# EAGLE design vh_21c (EAGLE 9.5.1)

## Sheet 1 of 2
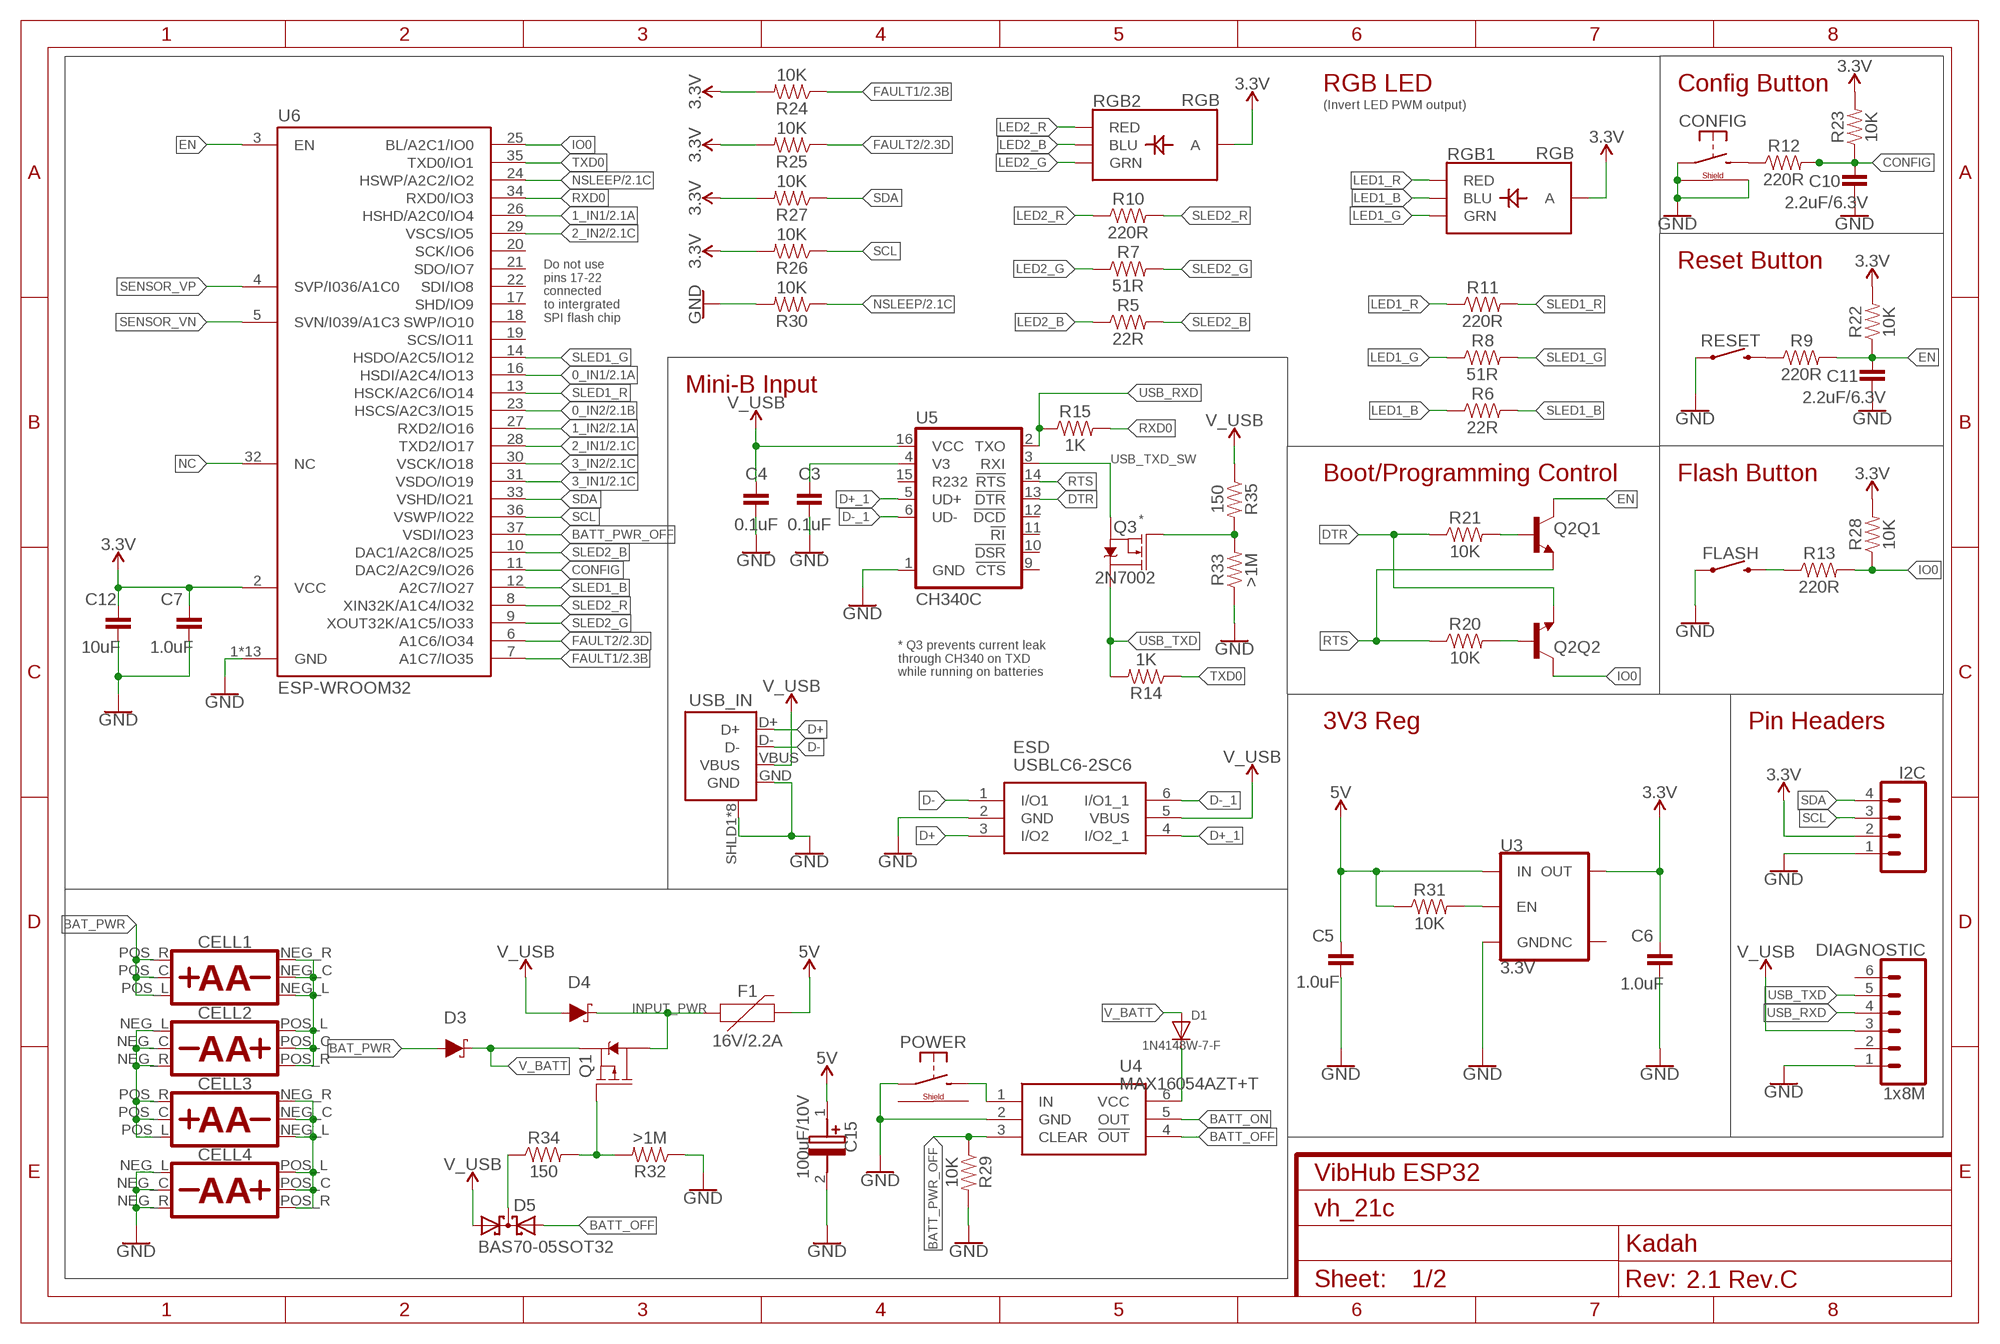
[diagram p0: schematic, sheet 1]
FRAME1 (FRAME-A4L): CNAME: VibHub ESP32; CREVISION: 2.1 Rev.C; DESIGNER: Kadah

### Parts
C3  0.1uF  CAPACITOR-0805  [C0805]
C4  0.1uF  CAPACITOR-0805  [C0805]
C5  1.0uF  CAPACITOR-0805  [C0805]
C6  1.0uF  CAPACITOR-0805  [C0805]
C7  1.0uF  CAPACITOR-0805  [C0805]
C10  2.2uF/6.3V  CAPACITOR-0805  [C0805]
C11  2.2uF/6.3V  CAPACITOR-0805  [C0805]
C12  10uF  CAPACITOR-0805  [C0805]
C15  100uF/10V  F931C107KCC  [CAPPM6032X270N]
CELL1  AA_590_596  [AA_590_596]
CELL2  AA_590_596  [AA_590_596]
CELL3  AA_590_596  [AA_590_596]
CELL4  AA_590_596  [AA_590_596]
CONFIG  MOMENTARY-SWITCH-SPST-RIGHTSQ75  [SW6X6_RIGHT_SQ73]
D1  1N4148W-7-F  DIODE-SOD-123  [SOD-123]
D3  3A/40V/500mV  DIODE-SCHOTTKY-B340A  [SMA-DIODE]
D4  3A/40V/500mV  DIODE-SCHOTTKY-B340A  [SMA-DIODE]
D5  BAS70-05SOT32  [SOT91P240X110-3]
DIAGNOSTIC  1x8M  CONN_06LOCK  [1X06_LOCK]
ESD  USBLC6-2SC6  [SOT95P280X145-6N]
F1  16V/2.2A  PPTC1812  [FUSC7035X90]
FLASH  MOMENTARY-SWITCH-SPST-SMD-6.0X3.5MM  [TACTILE_SWITCH_SMD_6.0X3.5MM]
I2C  CONN_04  [1X04]
POWER  MOMENTARY-SWITCH-SPST-RIGHTSQ75  [SW6X6_RIGHT_SQ73]
Q1  MOSFET_PCH-DMG2305UX-13  [SOT91P240X110-3]
Q2  TRANS_NPN_DUAL-MBT3904DW1T1  [SC70-6]
Q3  2N7002  MOSFET-NCH-BSS138  [SOT23-3]
R5  22R  RESISTOR0805  [0805]
R6  22R  RESISTOR0805  [0805]
R7  51R  RESISTOR0805  [0805]
R8  51R  RESISTOR0805  [0805]
R9  220R  RESISTOR0805  [0805]
R10  220R  RESISTOR0805  [0805]
R11  220R  RESISTOR0805  [0805]
R12  220R  RESISTOR0805  [0805]
R13  220R  RESISTOR0805  [0805]
R14  1K  RESISTOR0805  [0805]
R15  1K  RESISTOR0805  [0805]
R20  10K  RESISTOR0805  [0805]
R21  10K  RESISTOR0805  [0805]
R22  10K  RESISTOR0805  [0805]
R23  10K  RESISTOR0805  [0805]
R24  10K  RESISTOR0805  [0805]
R25  10K  RESISTOR0805  [0805]
R26  10K  RESISTOR0805  [0805]
R27  10K  RESISTOR0805  [0805]
R28  10K  RESISTOR0805  [0805]
R29  10K  RESISTOR0805  [0805]
R30  10K  RESISTOR0805  [0805]
R31  10K  RESISTOR0805  [0805]
R32  >1M  RESISTOR0805  [0805]
R33  >1M  RESISTOR0805  [0805]
R34  150  RESISTOR0805  [0805]
R35  150  RESISTOR0805  [0805]
RESET  MOMENTARY-SWITCH-SPST-SMD-6.0X3.5MM  [TACTILE_SWITCH_SMD_6.0X3.5MM]
RGB1  RGB  LED-RGB-CAPLCC  [P-LCC-4-3]
RGB2  RGB  LED-RGB-CAPLCC  [P-LCC-4-3]
U3  3.3V  V_REG_AP2112K-3.3V  [SOT23-5]
U4  MAX16054AZT+T  [SOT95P275X110-6N]
U5  CH340C  [SO016]
U6  ESP-WROOM32  [ESP-WROOM32]
USB_IN  USB-MICROB-2  [USB-MICROB-10118194]

### Nets
0_IN1: U6.16(HSDI/A2C4/IO13) ; also sheet 2
0_IN2: U6.23(HSCS/A2C3/IO15) ; also sheet 2
1_IN1: U6.26(HSHD/A2C0/IO4) ; also sheet 2
1_IN2: U6.27(RXD2/IO16) ; also sheet 2
2_IN1: U6.28(TXD2/IO17) ; also sheet 2
2_IN2: U6.29(VSCS/IO5) ; also sheet 2
3.3V: C6.1 C7.1 C12.1 I2C.2 R22.2 R23.2 R24.2 R25.2 R26.2 R27.2 R28.2 RGB1.4(A) RGB2.4(A) U3.5(OUT) U6.2(VCC)
3_IN1: U6.31(VSDO/IO19) ; also sheet 2
3_IN2: U6.30(VSCK/IO18) ; also sheet 2
5V: C5.1 C15.1(+) F1.2 R31.1 U3.1(IN) ; also sheet 2
BAT_PWR: CELL1.POS_C CELL1.POS_L CELL1.POS_R D3.A
BATT_OFF: D5.2(A2) U4.4(!OUT)
BATT_ON: U4.5(OUT)
BATT_PWR_OFF: R29.1 U4.3(CLEAR) U6.37(VSDI/IO23)
CONFIG: C10.1 R12.2 R23.1 U6.11(DAC2/A2C9/IO26)
D+: ESD.3(I/O2) USB_IN.D+
D+_1: ESD.4(I/O2_1) U5.5(UD+)
D-: ESD.1(I/O1) USB_IN.D-
D-_1: ESD.6(I/O1_1) U5.6(UD-)
DTR: Q2.1(Q2:E) R21.1 U5.13(!DTR)
EN: C11.1 Q2.3(Q1:C) R9.2 R22.1 U6.3(EN)
EN_BASE: Q2.5(Q1:B) R21.2
FAULT1: R24.1 U6.7(A1C7/IO35) ; also sheet 2
FAULT2: R25.1 U6.6(A1C6/IO34) ; also sheet 2
GND: C3.2 C4.2 C5.2 C6.2 C7.2 C10.2 C11.2 C12.2 C15.2(-) CELL4.NEG_C CELL4.NEG_L CELL4.NEG_R CONFIG.2(P1) CONFIG.SHLD@1(SHIELD1) CONFIG.SHLD@2(SHIELD2) DIAGNOSTIC.1 ESD.2(GND) FLASH.1 I2C.1 POWER.2(P1) R29.2 R30.2 R32.1 R33.1 RESET.1 U3.2(GND) U4.2(GND) U5.1(GND) U6.1(GND) U6.15(GND) U6.38(GND) U6.TP1(GND) U6.TP2(GND) U6.TP3(GND) U6.TP4(GND) U6.TP5(GND) U6.TP6(GND) U6.TP7(GND) U6.TP8(GND) U6.TP9(GND) U6.TP(GND) USB_IN.GND USB_IN.SHLD1(SHIELD) USB_IN.SHLD2(SHIELD) USB_IN.SHLD3(SHIELD) USB_IN.SHLD4(SHIELD) USB_IN.SHLD5(SHIELD) USB_IN.SHLD6(SHIELD) USB_IN.SHLD7(SHIELD) USB_IN.SHLD8(SHIELD) ; also sheet 2
INPUT_PWR: D4.C F1.1 Q1.3(D)
IO0: Q2.6(Q2:C) R13.2 R28.1 U6.25(BL/A2C1/IO0)
IO0_BASE: Q2.2(Q2:B) R20.2
LED1_B: R6.1 RGB1.3(BLU)
LED1_G: R8.1 RGB1.2(GRN)
LED1_R: R11.1 RGB1.1(RED)
LED2_B: R5.1 RGB2.3(BLU)
LED2_G: R7.1 RGB2.2(GRN)
LED2_R: R10.1 RGB2.1(RED)
N$1: R31.2 U3.3(EN)
N$2: C3.1 U5.4(V3)
N$3: D5.3(C) R34.1
N$4: POWER.1(S1) U4.1(IN)
N$5: D1.C U4.6(VCC)
N$6: R9.1 RESET.2
N$7: CELL1.NEG_C CELL1.NEG_L CELL1.NEG_R CELL2.POS_C CELL2.POS_L CELL2.POS_R
N$8: CELL2.NEG_C CELL2.NEG_L CELL2.NEG_R CELL3.POS_C CELL3.POS_L CELL3.POS_R
N$10: CELL3.NEG_C CELL3.NEG_L CELL3.NEG_R CELL4.POS_C CELL4.POS_L CELL4.POS_R
N$12: CONFIG.1(S1) R12.1
N$15: Q1.1(G) R32.2 R34.2
N$16: Q3.1(G) R33.2 R35.2
N$31: FLASH.2 R13.1
NC: U6.32(NC)
NSLEEP: R30.1 U6.24(HSWP/A2C2/IO2) ; also sheet 2
RTS: Q2.4(Q1:E) R20.1 U5.14(!RTS)
RXD0: R15.2 U6.34(RXD0/IO3)
SCL: I2C.3 R26.1 U6.36(VSWP/IO22)
SDA: I2C.4 R27.1 U6.33(VSHD/IO21)
SENSOR_VN: U6.5(SVN/I039/A1C3)
SENSOR_VP: U6.4(SVP/I036/A1C0)
SLED1_B: R6.2 U6.12(A2C7/IO27)
SLED1_G: R8.2 U6.14(HSDO/A2C5/IO12)
SLED1_R: R11.2 U6.13(HSCK/A2C6/IO14)
SLED2_B: R5.2 U6.10(DAC1/A2C8/IO25)
SLED2_G: R7.2 U6.9(XOUT32K/A1C5/IO33)
SLED2_R: R10.2 U6.8(XIN32K/A1C4/IO32)
TXD0: R14.1 U6.35(TXD0/IO1)
USB_RXD: DIAGNOSTIC.4 R15.1 U5.2(TXO)
USB_TXD: DIAGNOSTIC.5 Q3.3(D) R14.2
USB_TXD_SW: Q3.2(S) U5.3(RXI)
V_BATT: D1.A D3.C Q1.2(S)
V_USB: C4.1 D4.A D5.1(A1) DIAGNOSTIC.3 ESD.5(VBUS) R35.1 U5.16(VCC) USB_IN.VBUS
Unconnected: DIAGNOSTIC.2 DIAGNOSTIC.6 POWER.SHLD@1(SHIELD1) POWER.SHLD@2(SHIELD2) U3.4(NC) U5.9(!CTS) U5.10(!DSR) U5.11(!RI) U5.12(!DCD) U5.15(R232) U6.17(SHD/IO9) U6.18(SWP/IO10) U6.19(SCS/IO11) U6.20(SCK/IO6) U6.21(SDO/IO7) U6.22(SDI/IO8)

### Notes on the sheet
- RGB LED | Config Button
- (Invert LED PWM output)
- Reset Button
- Do not use
  pins 17-22
  connected
  to intergrated
  SPI flash chip
- Mini-B Input
- Boot/Programming Control | Flash Button
- *
- * Q3 prevents current leak
  through CH340 on TXD 
  while running on batteries
- 3V3 Reg | Pin Headers

## Sheet 2 of 2
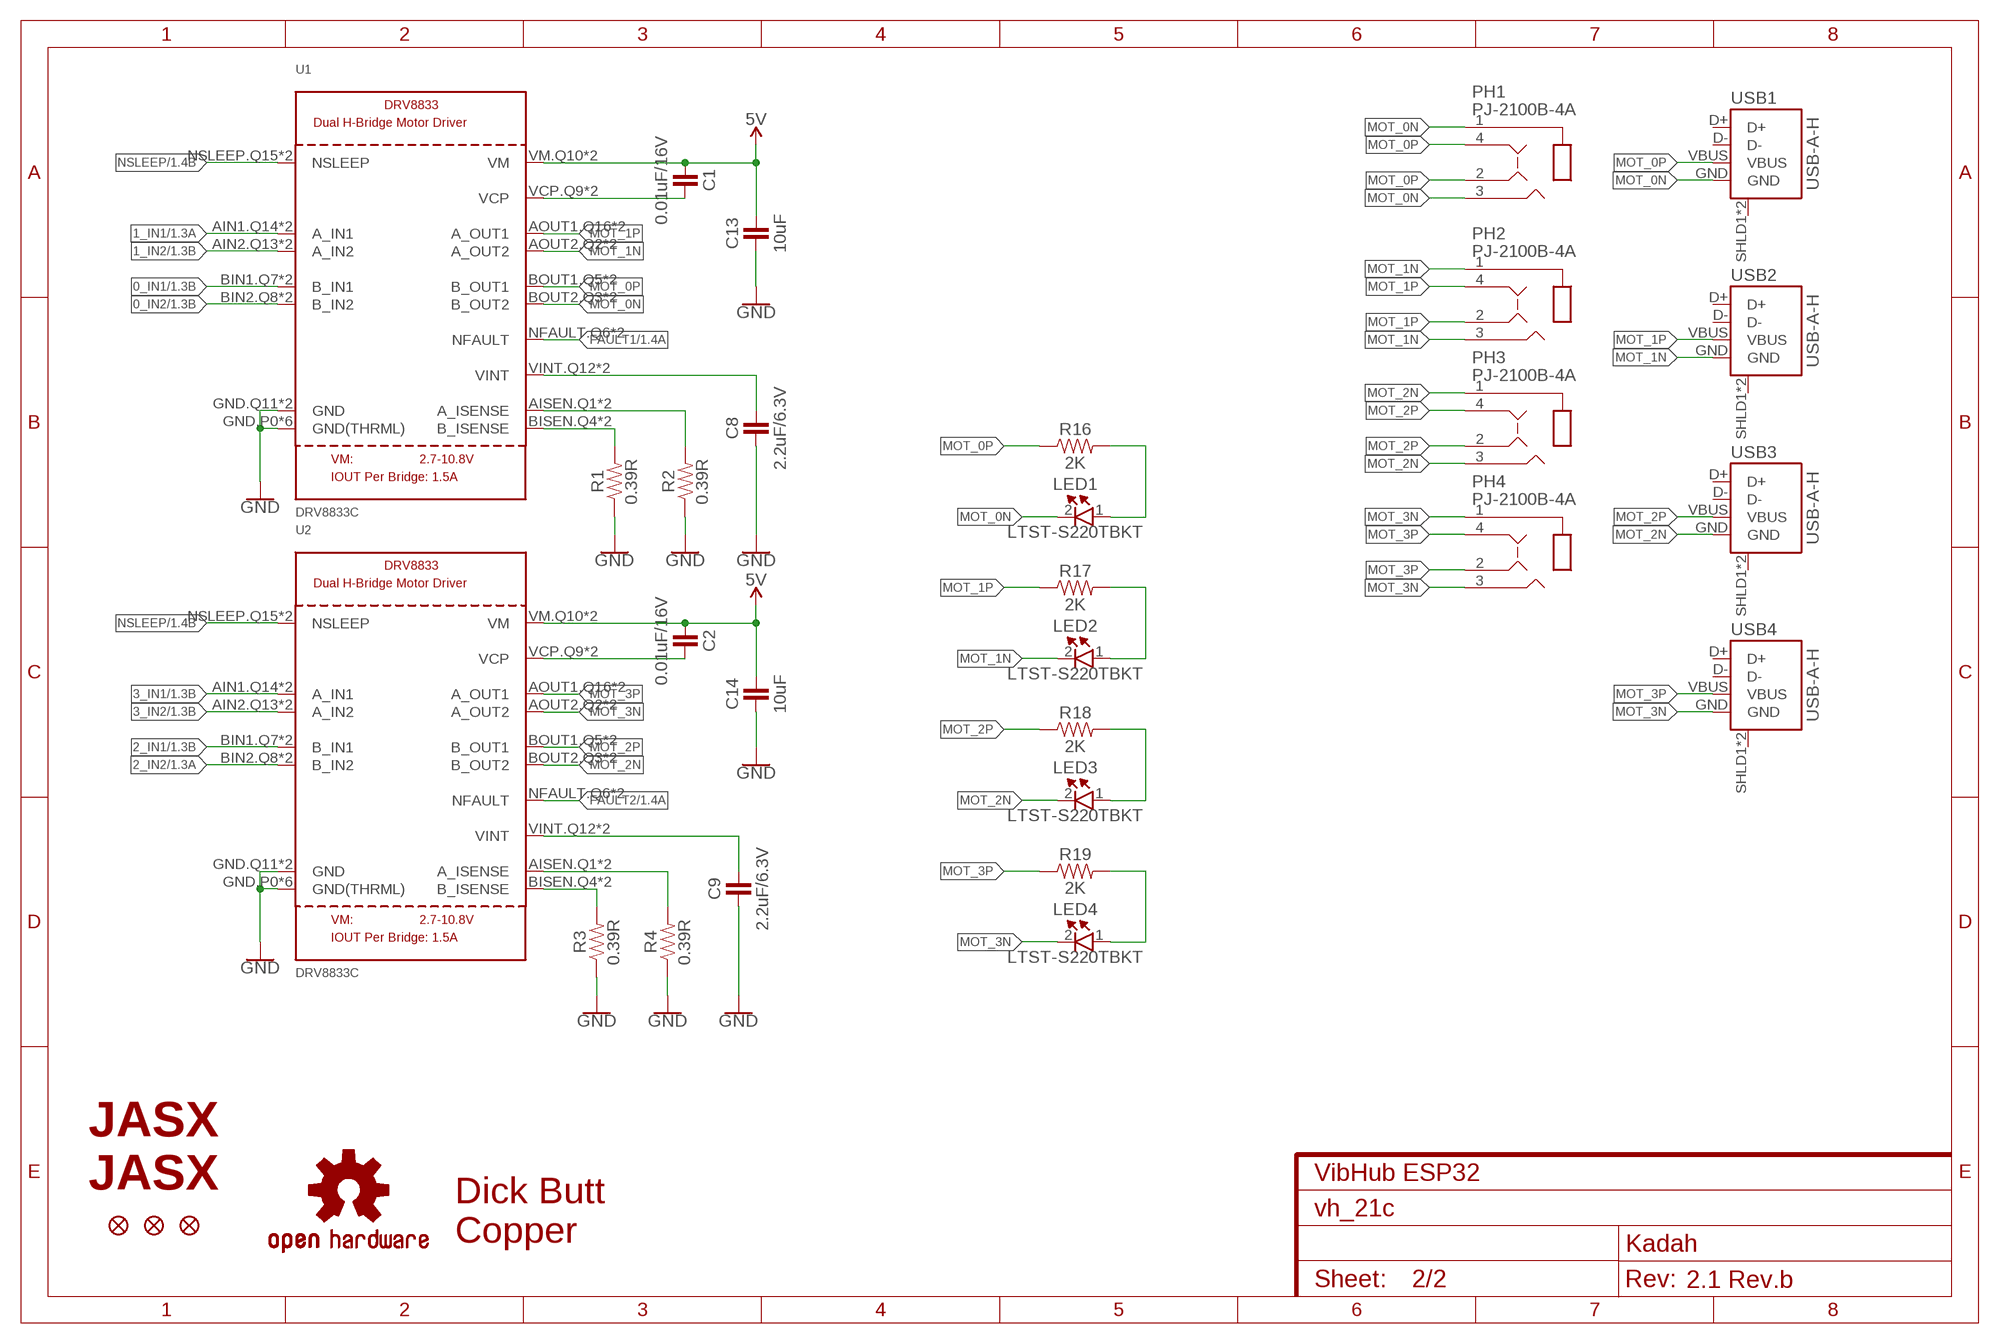
[diagram p1: schematic, sheet 2]
FRAME2 (FRAME-A4L): CNAME: VibHub ESP32; CREVISION: 2.1 Rev.b; DESIGNER: Kadah

### Parts
C1  0.01uF/16V  CAPACITOR-0805  [C0805]
C2  0.01uF/16V  CAPACITOR-0805  [C0805]
C8  2.2uF/6.3V  CAPACITOR-0805  [C0805]
C9  2.2uF/6.3V  CAPACITOR-0805  [C0805]
C13  10uF  CAPACITOR-0805  [C0805]
C14  10uF  CAPACITOR-0805  [C0805]
FD1  FIDUCIAL1X2  [FIDUCIAL-1X2]
FD2  FIDUCIAL1X2  [FIDUCIAL-1X2]
FD3  FIDUCIAL1X2  [FIDUCIAL-1X2]
LED1  LTST-S220TBKT  [LTST-S220KFKT]
LED2  LTST-S220TBKT  [LTST-S220KFKT]
LED3  LTST-S220TBKT  [LTST-S220KFKT]
LED4  LTST-S220TBKT  [LTST-S220KFKT]
LOGO1  OSHW-LOGOM  [OSHW-LOGO-M]
LOGO2  JASX_LOGO_MID  [JASX_LOGO_M]
LOGO3  DICKBUTTCOPPER  [DICKBUTT_COPPER]
LOGO4  JASX_LOGO_MID  [JASX_LOGO_M]
PH1  PJ-2100B-4A  [PJ2100B4A]
PH2  PJ-2100B-4A  [PJ2100B4A]
PH3  PJ-2100B-4A  [PJ2100B4A]
PH4  PJ-2100B-4A  [PJ2100B4A]
R1  0.39R  RESISTOR0805  [0805]
R2  0.39R  RESISTOR0805  [0805]
R3  0.39R  RESISTOR0805  [0805]
R4  0.39R  RESISTOR0805  [0805]
R16  2K  RESISTOR0805  [0805]
R17  2K  RESISTOR0805  [0805]
R18  2K  RESISTOR0805  [0805]
R19  2K  RESISTOR0805  [0805]
U1  DRV8833C  DRV8833COMBO  [DRV8833_COMBO]
U2  DRV8833C  DRV8833COMBO  [DRV8833_COMBO]
USB1  USB-A-H  [USB-A-H]
USB2  USB-A-H  [USB-A-H]
USB3  USB-A-H  [USB-A-H]
USB4  USB-A-H  [USB-A-H]

### Nets
0_IN1: U1.BIN1.Q7(B_IN1) U1.BIN1.T9(B_IN1) ; also sheet 1
0_IN2: U1.BIN2.Q8(B_IN2) U1.BIN2.T10(B_IN2) ; also sheet 1
1_IN1: U1.AIN1.Q14(A_IN1) U1.AIN1.T16(A_IN1) ; also sheet 1
1_IN2: U1.AIN2.Q13(A_IN2) U1.AIN2.T15(A_IN2) ; also sheet 1
2_IN1: U2.BIN1.Q7(B_IN1) U2.BIN1.T9(B_IN1) ; also sheet 1
2_IN2: U2.BIN2.Q8(B_IN2) U2.BIN2.T10(B_IN2) ; also sheet 1
3_IN1: U2.AIN1.Q14(A_IN1) U2.AIN1.T16(A_IN1) ; also sheet 1
3_IN2: U2.AIN2.Q13(A_IN2) U2.AIN2.T15(A_IN2) ; also sheet 1
5V: C1.1 C2.1 C13.2 C14.2 U1.VM.Q10(VM) U1.VM.T12(VM) U2.VM.Q10(VM) U2.VM.T12(VM) ; also sheet 1
A_ISENSE0: R2.2 U1.AISEN.Q1(A_ISENSE) U1.AISEN.T3(A_ISENSE)
A_ISENSE1: R4.2 U2.AISEN.Q1(A_ISENSE) U2.AISEN.T3(A_ISENSE)
B_ISENSE0: R1.2 U1.BISEN.Q4(B_ISENSE) U1.BISEN.T6(B_ISENSE)
B_ISENSE1: R3.2 U2.BISEN.Q4(B_ISENSE) U2.BISEN.T6(B_ISENSE)
FAULT1: U1.NFAULT.Q6(NFAULT) U1.NFAULT.T8(NFAULT) ; also sheet 1
FAULT2: U2.NFAULT.Q6(NFAULT) U2.NFAULT.T8(NFAULT) ; also sheet 1
GND: C8.1 C9.1 C13.1 C14.1 R1.1 R2.1 R3.1 R4.1 U1.GND.P0(GND(THRML)) U1.GND.P1(GND(THRML)) U1.GND.P2(GND(THRML)) U1.GND.P3(GND(THRML)) U1.GND.P4(GND(THRML)) U1.GND.P5(GND(THRML)) U1.GND.Q11(GND) U1.GND.T13(GND) U2.GND.P0(GND(THRML)) U2.GND.P1(GND(THRML)) U2.GND.P2(GND(THRML)) U2.GND.P3(GND(THRML)) U2.GND.P4(GND(THRML)) U2.GND.P5(GND(THRML)) U2.GND.Q11(GND) U2.GND.T13(GND) ; also sheet 1
MOT_0N: LED1.2(K) PH1.1 PH1.3 U1.BOUT2.Q3(B_OUT2) U1.BOUT2.T5(B_OUT2) USB1.GND
MOT_0P: PH1.2 PH1.4 R16.1 U1.BOUT1.Q5(B_OUT1) U1.BOUT1.T7(B_OUT1) USB1.VBUS
MOT_1N: LED2.2(K) PH2.1 PH2.3 U1.AOUT2.Q2(A_OUT2) U1.AOUT2.T4(A_OUT2) USB2.GND
MOT_1P: PH2.2 PH2.4 R17.1 U1.AOUT1.Q16(A_OUT1) U1.AOUT1.T2(A_OUT1) USB2.VBUS
MOT_2N: LED3.2(K) PH3.1 PH3.3 U2.BOUT2.Q3(B_OUT2) U2.BOUT2.T5(B_OUT2) USB3.GND
MOT_2P: PH3.2 PH3.4 R18.1 U2.BOUT1.Q5(B_OUT1) U2.BOUT1.T7(B_OUT1) USB3.VBUS
MOT_3N: LED4.2(K) PH4.1 PH4.3 U2.AOUT2.Q2(A_OUT2) U2.AOUT2.T4(A_OUT2) USB4.GND
MOT_3P: PH4.2 PH4.4 R19.1 U2.AOUT1.Q16(A_OUT1) U2.AOUT1.T2(A_OUT1) USB4.VBUS
N$11: LED1.1(A) R16.2
N$13: LED2.1(A) R17.2
N$14: LED3.1(A) R18.2
N$17: LED4.1(A) R19.2
NSLEEP: U1.NSLEEP.Q15(NSLEEP) U1.NSLEEP.T1(NSLEEP) U2.NSLEEP.Q15(NSLEEP) U2.NSLEEP.T1(NSLEEP) ; also sheet 1
VCP0: C1.2 U1.VCP.Q9(VCP) U1.VCP.T11(VCP)
VCP1: C2.2 U2.VCP.Q9(VCP) U2.VCP.T11(VCP)
VINT0: C8.2 U1.VINT.Q12(VINT) U1.VINT.T14(VINT)
VINT1: C9.2 U2.VINT.Q12(VINT) U2.VINT.T14(VINT)
Unconnected: USB1.D+ USB1.D- USB1.SHLD1(SHIELD) USB1.SHLD2(SHIELD) USB2.D+ USB2.D- USB2.SHLD1(SHIELD) USB2.SHLD2(SHIELD) USB3.D+ USB3.D- USB3.SHLD1(SHIELD) USB3.SHLD2(SHIELD) USB4.D+ USB4.D- USB4.SHLD1(SHIELD) USB4.SHLD2(SHIELD)

## Library data of the parts
C1-C14 = vibhud:CAPACITOR: Capacitors ...2.2uF @ 6.3V -> 0402 ...4.7uF @ 6.3V -> 0603 ...10uF @ 16V -> 0805 ...22uF @ 25V -> 1206
C15 = F931C107KCC:F931C107KCC: Cap Tant Solid 100uF 16V C CASE 10% (6 X 3.2 X 2.5mm) Inward L SMD 6032-27 0.7 Ohm 125C T/R Source: Datasheet <http://datasheets.avx.com/F93.pdf>; DESCRIPTION: Cap Tant Solid 100uF 16V C CASE 10% (6 X 3.2 X 2.5mm) Inward L SMD 6032-27 0.7 Ohm 125C T/R; HEIGHT: 2.7mm; MANUFACTURER_NAME: AVX; MANUFACTURER_PART_NUMBER: F931C107KCC
CELL1-CELL4 = AA_590_596:AA_590_596; DESCRIPTION: KEYSTONE - 590 & 596; HEIGHT: 12.56mm; MANUFACTURE_NAME: Keystone Electronics
CONFIG POWER = vibhud:MOMENTARY-SWITCH-SPST-RIGHT
D1 = vibhud:DIODE: Diodes
D3 D4 = vibhud:DIODE-SCHOTTKY: Schottky diode A Schottky diode is a semiconductor diode which has a low forward voltage drop and a very fast switching action.; PROD_ID: DIO-09886
D5 = vibhud:BAS70-05: Silicon Schottky Diodes General-purpose diode for high-speed switching
DIAGNOSTIC = vibhud:CONN_06: Multi connection point. Often used as Generic Header-pin footprint for 0.1 inch spaced/style header connections On any of the 0.1 inch spaced packages, you can populate with these: Break Away Headers - Straight <https://www.sparkfun.com/products/116> (PRT-00116) Break Away Male Headers - Right Angle <https://www.sparkfun.com/products/553> (PRT-00553) Female Headers <https://www.sparkfun.com/products/115> (PRT-00115) Break Away Headers - Machine Pin <https://www.sparkfun.com/products/117> (PRT-00117) Break Away Female Headers - Swiss Machine Pin <https://www.sparkfun.com/products/743> (PRT-00743) Arduino Stackable Header - 6 Pin <https://www.sparkfun.com/products/9280> (PRT-09280) For SCREWTERMINALS and SPRING TERMINALS visit here: Screw Terimnals on SparkFun.com <https://www.sparkfun.com/search/results?term=Screw+Terminals> (5mm/3.5mm/2.54mm spacing) This device is also useful as a general connection point to wire up your design to another part of your project. Our various solder wires solder well into these plated through hole pads. Hook-Up Wire - Assortment (Stranded, 22 AWG) <https://www.sparkfun.com/products/11375> (PRT-11375) Hook-Up Wire - Assortment (Solid Core, 22 AWG) <https://www.sparkfun.com/products/11367> (PRT-11367) View the entire wire category on our website here <https://www.sparkfun.com/categories/141>
ESD = USBLC6-2SC6:USBLC6-2SC6: TVS Diode Array Uni-Directional USBLC6-2SC6 17V, SOT-23 6-Pin Source: Datasheet <http://www.st.com/st-web-ui/static/active/en/resource/technical/document/datasheet/CD00050750.pdf>; ALLIED_NUMBER: 70389689; ALLIED_PRICE-STOCK: http://www.alliedelec.com/stmicroelectronics-usblc6-2sc6/70389689/; DESCRIPTION: TVS Diode Array Uni-Directional USBLC6-2SC6 17V, SOT-23 6-Pin; HEIGHT: 1.45mm; MANUFACTURER_NAME: STMicroelectronics; MANUFACTURER_PART_NUMBER: USBLC6-2SC6; MOUSER_PART_NUMBER: 511-USBLC6-2SC6; MOUSER_PRICE-STOCK: https://www.mouser.com/Search/Refine.aspx?Keyword=511-USBLC6-2SC6; RS_PART_NUMBER: 6247693P; RS_PRICE-STOCK: http://uk.rs-online.com/web/p/products/6247693P
F1 = vibhud:PPTC: Resettable Fuse PPTC Resettable Fuse. Really a sort of resistor with a polymeric positive temperature coefficient whose resistance increases dramatically with an increase in temperature. When heated by the power passing through the resistance rises causing the current to be limited, protecting the circuit. This is achieved by the transition of the polymer from a crystalline to an amorphous state where the conductive carbon separates breaking the conductive pathways found in the cool crystalline structure. When a PPTC cools back down it resumes conducting letting the circuit turn back on. SparkFun Products: SparkFun RedBoard - Programmed with Arduino <https://www.sparkfun.com/products/12757> Pro Micro - 5V/16MHz <https://www.sparkfun.com/products/12640> Arduino Pro 328 - 5V/16MHz <https://www.sparkfun.com/products/10915> MP3 Trigger <https://www.sparkfun.com/products/13720>
FD1-FD3 = vibhud:FIDUCIAL: Fiducial Alignment Points Point-of-reference for pick-and-place machines and other optical instruments.
FLASH RESET = vibhud:MOMENTARY-SWITCH-SPST: Momentary Switch (Pushbutton) - SPST Normally-open (NO) SPST momentary switches (buttons, pushbuttons). Variants PTH-12MM - 12mm square, through-hole Momentary Pushbutton Switch - 12mm Square <https://www.sparkfun.com/products/9190> (COM-09190) PTH-6.0MM, PTH-6.0MM-KIT - 6.0mm square, through-hole Mini Pushbutton Switch <https://www.sparkfun.com/products/97> (COM-00097) KIT package intended for soldering kit's - only one side of pads' copper is exposed. PTH-RIGHT-ANGLE-KIT - Right-angle, through-hole Right Angle Tactile Button <https://www.sparkfun.com/products/10791> - Used on SparkFun BigTime Watch Kit <https://www.sparkfun.com/products/11734> SMD-12MM - 12mm square, surface-mount Tactile Button - SMD (12mm) <https://www.sparkfun.com/products/12993> (COM-12993) Used on SparkFun PicoBoard <https://www.sparkfun.com/products/11888> SMD-4.5MM - 4.5mm Square Trackball Switch Used on SparkFun Blackberry Trackballer Breakout <https://www.sparkfun.com/products/13169> SMD-4.6MMX2.8MM - 4.60mm x 2.80mm, surface mount Used on SparkFun SAMD21 Mini Breakout <https://www.sparkfun.com/products/13664> SMD-5.2MM, SMD-5.2-REDUNDANT - 5.2mm square, surface-mount Mini Pushbutton Switch - SMD <https://www.sparkfun.com/products/8720> (COM-08720) Used on Arduino Pro Mini <https://www.sparkfun.com/products/11114> REDUNDANT package connects both switch circuits together SMD-6.0X3.5MM - 6.0 x 3.5mm, surface mount Momentary Reset Switch SMD <https://www.sparkfun.com/products/8229> (COM-08229) SMD-6.2MM-TALL - 6.2mm square, surface mount Tactile Button - SMD (6mm) <https://www.sparkfun.com/products/12992> Used on SparkFun Digital Sandbox <https://www.sparkfun.com/products/12651> SMD-RIGHT-ANGLE - Right-angle, surface mount Used on SparkFun Block for Intel® Edison - Arduino <https://www.sparkfun.com/products/13036>; PROD_ID: SWCH-00815; SF_SKU: COM-08229
I2C = vibhud:CONN_04: Multi connection point. Often used as Generic Header-pin footprint for 0.1 inch spaced/style header connections On any of the 0.1 inch spaced packages, you can populate with these: Break Away Headers - Straight <https://www.sparkfun.com/products/116> (PRT-00116) Break Away Male Headers - Right Angle <https://www.sparkfun.com/products/553> (PRT-00553) Female Headers <https://www.sparkfun.com/products/115> (PRT-00115) Break Away Headers - Machine Pin <https://www.sparkfun.com/products/117> (PRT-00117) Break Away Female Headers - Swiss Machine Pin <https://www.sparkfun.com/products/743> (PRT-00743) For SCREWTERMINALS and SPRING TERMINALS visit here: Screw Terimnals on SparkFun.com <https://www.sparkfun.com/search/results?term=Screw+Terminals> (5mm/3.5mm/2.54mm spacing) This device is also useful as a general connection point to wire up your design to another part of your project. Our various solder wires solder well into these plated through hole pads. Hook-Up Wire - Assortment (Stranded, 22 AWG) <https://www.sparkfun.com/products/11375> (PRT-11375) Hook-Up Wire - Assortment (Solid Core, 22 AWG) <https://www.sparkfun.com/products/11367> (PRT-11367) View the entire wire category on our website here <https://www.sparkfun.com/categories/141> Special notes: Molex polarized connector foot print use with SKU : PRT-08231 with associated crimp pins and housings. 1MM SMD Version SKU: PRT-10208; PROD_ID: CONN-09696
LED1-LED4 = LTST-S220TBKT:LTST-S220TBKT: LED,0805,Side View,Blue,30mcd Lite-On LTST-S220TBKT Blue LED, 475 nm 2012 (0805) Side View, Rectangle Lens SMD package Source: Datasheet <http://optoelectronics.liteon.com/upload/download/DS22-2000-239/LTST-S220TBKT.pdf>; DESCRIPTION: LED,0805,Side View,Blue,30mcd Lite-On LTST-S220TBKT Blue LED, 475 nm 2012 (0805) Side View, Rectangle Lens SMD package; HEIGHT: mm; MANUFACTURER_NAME: Lite-On; MANUFACTURER_PART_NUMBER: LTST-S220TBKT
LOGO1 = vibhud:OSHW-LOGO: Open-Source Hardware (OSHW) Logo This logo indicates the piece of hardware it is found on incorporates a OSHW license and/or adheres to the definition of open source hardware found here: http://freedomdefined.org/OSHW
LOGO2 LOGO4 = vibhud:JASX_LOGO
LOGO3 = vibhud:DICKBUTT
PH1-PH4 = PJ-2100B-4A:PJ-2100B-4A: Audio & Video Connectors Female 11*5mm RoHS Source: Datasheet <https://datasheet.lcsc.com/szlcsc/Korean-Hroparts-Elec-PJ-2100B-4A_C145822.pdf>; DESCRIPTION: Audio & Video Connectors Female 11*5mm RoHS; HEIGHT: 5mm; MANUFACTURER_NAME: Korean Hroparts Elec; MANUFACTURER_PART_NUMBER: PJ-2100B-4A
Q1 = vibhud:MOSFET_PCH: P-channel MOSFETs Voltage controlled devices that allow control of high current outputs. SparkFun Products: SparkFun ESP32 Thing <https://www.sparkfun.com/products/13907> SparkFun ESP8266 Thing <https://www.sparkfun.com/products/13231>
Q2 = vibhud:TRANS_NPN_DUAL: Dual NPN Transistors in Single Package The MBT3904W1 puts two general purpose 3904 NPN transistors in a single package. Datasheet <http://www.onsemi.com/pub_link/Collateral/MBT3904DW1T1-D.PDF> SparkFun Products: SparkFun ESP32 Thing <https://www.sparkfun.com/products/13907>; PROD_ID: TRANS-13337
Q3 = vibhud:MOSFET-NCH: N-channel MOSFETs Voltage controlled devices that allow control of high current outputs. SparkFun Products: SparkFun OpenScale <https://www.sparkfun.com/products/13261> SparkFun Digital Sandbox <https://www.sparkfun.com/products/12651> SparkFun Monster Moto Shield <https://www.sparkfun.com/products/10182> SparkFun MOSFET Power Controller <https://www.sparkfun.com/products/11214>; PROD_ID: TRANS-00830; VALUE: 220mA/50V/3.5Ω
R1-R35 = vibhud:RESISTOR: Generic Resistor Package
RGB1 RGB2 = vibhud:LED-RGB-CA: LED-RGB Diffused Common Anode Packages: LED RGB-THRU P-LCC-4-3 LED-TRICOLOR-SMD SparkFun Products: RGB Diffused Common Anode- Diffuse <[https://www.sparkfun.com/products/10821]> RGB Diffused Common Anode - Clear <[https://www.sparkfun.com/products/10820]> Qduino Mini <[https://www.sparkfun.com/products/13614]> Triple Output LED RGB - SMD <https://www.sparkfun.com/products/7844>; PROD_ID: DIO-12986
U1 U2 = vibhud:DRV8833: DRV8833 Dual H-Bridge Motor Driver -- HTSSOP Package
U3 = vibhud:V_REG_AP2112: AP2112 - 600mA CMOS LDO Regulator w/ Enable The AP2112 is CMOS process low dropout linear regulator with enable function, the regulator delivers a guaranteed 600mA (min.) continuous load current. Features Output Voltage Accuracy: ±1.5% Output Current: 600mA (Min.) Foldback Short Current Protection: 50mA Enable Function to Turn ON/OFF VOUT Low Dropout Voltage (3.3V): 250mV (Typ.) @IOUT=600mA Excellent Load Regulation: 0.2%/A (Typ.) Excellent Line Regulation: 0.02%/V (Typ.) Low Quiescent Current: 55μA (Typ.) Low Standby Current: 0.01μA (Typ.) Low Output Noise: 50μVRMS PSRR: 100Hz -65dB, 1kHz -65dB OTSD Protection Stable with 1.0μF Flexible Cap: Ceramic, Tantalum and Aluminum Electrolytic Operation Temperature Range: -40°C to 85°C ESD: MM 400V, HBM 4000V; PROD_ID: VREG-12457
U4 = MAX16054AZT+T:MAX16054AZT+T: On Off Controller, Debounce, 15kV ESD MAX16054AZT+T, Voltage Supervisor No Push Button Controller 6-Pin SOT-23 Source: Datasheet <http://docs-emea.rs-online.com/webdocs/1050/0900766b810509a1.pdf>; DESCRIPTION: On Off Controller, Debounce, 15kV ESD MAX16054AZT+T, Voltage Supervisor No Push Button Controller 6-Pin SOT-23; HEIGHT: 1.1mm; MANUFACTURER_NAME: Maxim Integrated; MANUFACTURER_PART_NUMBER: MAX16054AZT+T; MOUSER_PART_NUMBER: 700-MAX16054AZTT; MOUSER_PRICE-STOCK: https://www.mouser.com/Search/Refine.aspx?Keyword=700-MAX16054AZTT; RS_PART_NUMBER: 7512623P; RS_PRICE-STOCK: http://uk.rs-online.com/web/p/products/7512623P
U5 = vibhud:CH340C; PROD_ID: IC-14038
U6 = vibhud:ESP-WROOM32: Espressif ESP-WROOM-32 ESP32 WiFi/WLAN + Bluetooth/BLE Module Compatible with AI-Thinker ESP-32S Module.
USB1-USB4 = vibhud:USB: USB Connectors
USB_IN = vibhud:USB: USB Connectors; DIGIKEY: 609-4618-6-ND

## Board
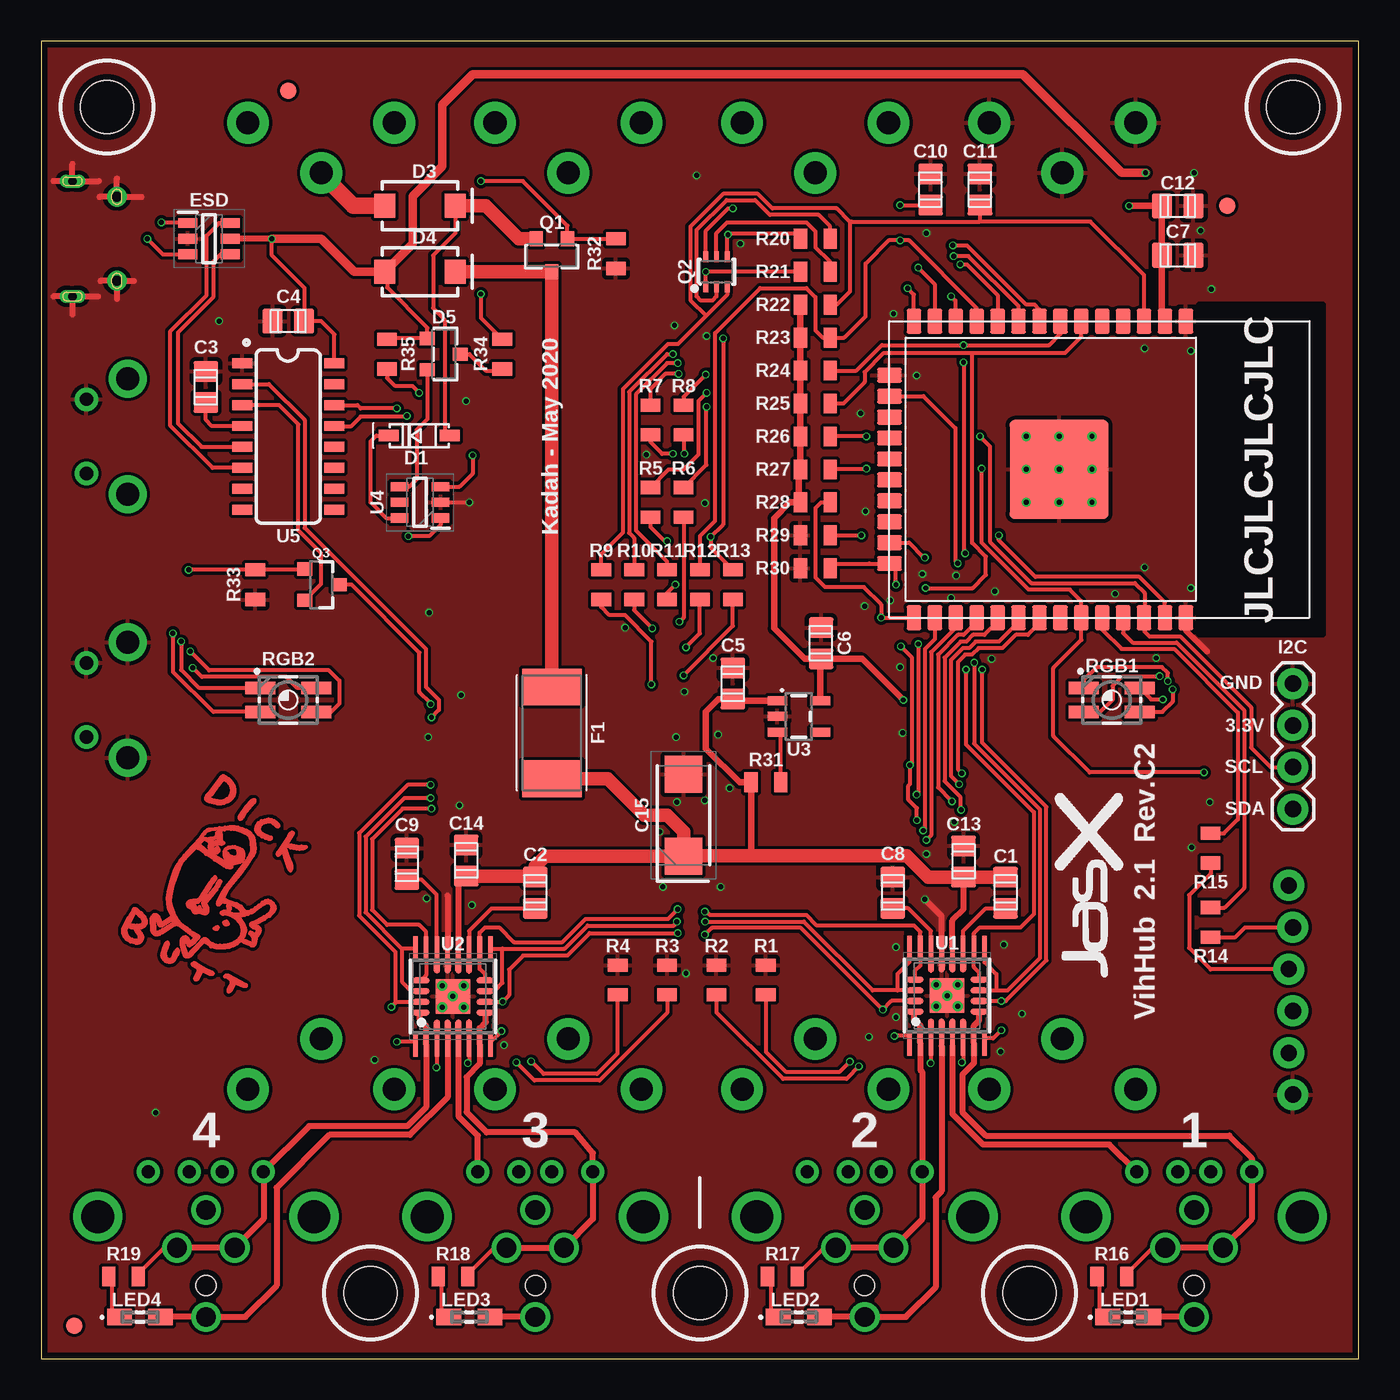
[diagram p2: board, top side]
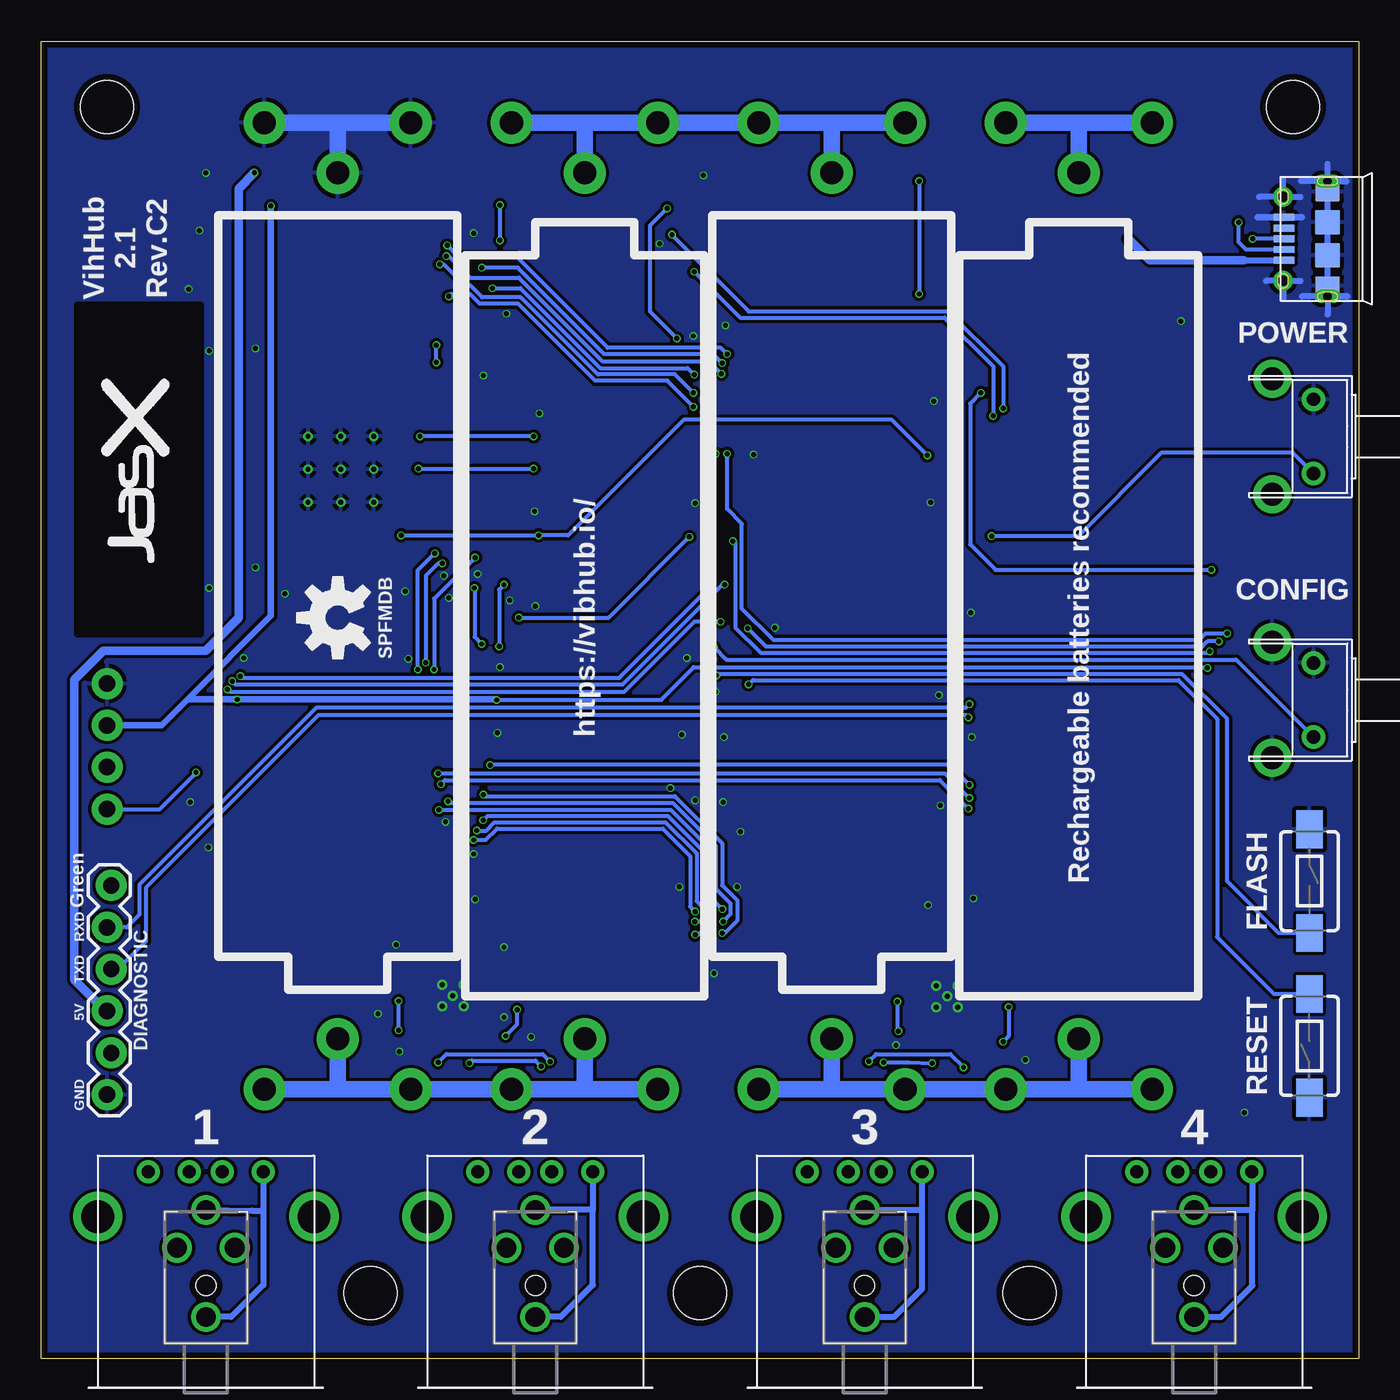
[diagram p3: board, bottom side, seen from below]

Size 80 x 80 mm. Coordinates in mm from the lower left corner, seen from the top.
Outline: 0,0 80,0 80,80 0,80 0,0
Copper layers (1*16): Top 0.035559375mm / dielectric 1.6mm / Bottom 0.035559375mm
Design rules "jlcpcb2layer_new": minimum track width 5mil, minimum drill 0.2mm, track to track 5mil, track to pad 5mil, pad to pad 5mil, via to via 5mil, smd to smd 5mil, copper to edge 15mil, drill to drill 6mil, minimum pad ring 5mil, minimum via ring 3mil, stop-mask expansion 2.5mil, vias tented up to drill 0mil, thermal gap 10mil
Holes 3.2 mm at 76,76 4,76 40,4 20,4 60,4

### Footprints (pad centres in the part's own frame; a part is rotated, then mirrored left to right if it is on the bottom)
C0805 = smd 1.5 x 1.25: 1 0,0.95; 2 0,-0.95
CAPPM6032X270N = smd 2.25 x 2.25: 1 -2.5,0; 2 2.5,0
AA_590_596 = drill 1.4 pad 2.54: NEG_C 0,-52.58; NEG_L -4.445,-55.63; NEG_R 4.445,-55.63; POS_C 0,0; POS_L -4.445,3.05; POS_R 4.445,3.05
SW6X6_RIGHT_SQ73 = drill 0.8 pad 1.422: 1 -2.25,-1.25; 2 2.25,-1.25 | drill 1.4 pad 2.3: SHLD@1 -3.5,1.25; SHLD@2 3.5,1.25
SOD-123 = smd 1.2 x 0.7: A 1.85,0; C -1.85,0
SMA-DIODE = smd 1.27 x 1.47: A -2.15,0; C 2.15,0
SOT91P240X110-3 = smd 0.9 x 0.8: 1 -1,0.95; 2 -1,-0.95; 3 1,0
1X06_LOCK = drill 1 pad 1.88: 1 0,0; 2 2.54,-0.254; 3 5.08,0; 4 7.62,-0.254; 5 10.16,0; 6 12.7,-0.254
SOT95P280X145-6N = smd 1.15 x 0.6: 1 -1.3,0.95; 2 -1.3,0; 3 -1.3,-0.95; 4 1.3,-0.95; 5 1.3,0; 6 1.3,0.95
FUSC7035X90 = smd 2.242 x 3.612: 1 -2.79,0; 2 2.79,0
FIDUCIAL-1X2 = smd 1 x 1: 1 0,0
TACTILE_SWITCH_SMD_6.0X3.5MM = smd 2.3 x 1.6: 1 -3.15,0; 2 3.15,0
1X04 = drill 1 pad 1.88: 1 0,0; 2 2.54,0; 3 5.08,0; 4 7.62,0
LTST-S220KFKT = smd 1.5 x 1: 1 -1.25,0; 2 1.25,0
PJ2100B4A = drill 1.2: 1 0,0; 2 4.2,1.75; 3 6.5,0; 4 4.2,-1.75 | hole 1.2: 1.9,0
SC70-6 = smd 0.3 x 0.66: 1 -0.65,-0.92; 2 0,-0.92; 3 0.65,-0.92; 4 0.65,0.92; 5 0,0.92; 6 -0.65,0.92
SOT23-3 = smd 0.8 x 0.9: 1 -0.95,-1; 2 0.95,-1; 3 0,1.1
0805 = smd 0.8 x 1.2: 1 -0.9,0; 2 0.9,0
P-LCC-4-3 = smd 1.8 x 0.75: 1 -1.7,0.725; 2 -1.7,-0.725; 3 1.7,-0.725; 4 1.7,0.725
DRV8833_COMBO = smd 0.35 x 1.05: AIN1.Q14 0.325,1.95; AIN2.Q13 0.975,1.95; AOUT1.Q16 -0.975,1.95; BIN1.Q7 0.325,-1.95; BIN2.Q8 0.975,-1.95; BOUT1.Q5 -0.975,-1.95; NFAULT.Q6 -0.325,-1.95; NSLEEP.Q15 -0.325,1.95 | smd 1.5 x 0.35: AIN1.T16 2.9,2.275; AIN2.T15 2.9,1.625; AISEN.T3 -2.9,0.975; AOUT1.T2 -2.9,1.625; AOUT2.T4 -2.9,0.325; BIN1.T9 2.9,-2.275; BIN2.T10 2.9,-1.625; BISEN.T6 -2.9,-0.975; BOUT1.T7 -2.9,-1.625; BOUT2.T5 -2.9,-0.325; GND.T13 2.9,0.325; NFAULT.T8 -2.9,-2.275; NSLEEP.T1 -2.9,2.275; VCP.T11 2.9,-0.975; VINT.T14 2.9,0.975; VM.T12 2.9,-0.325 | smd 1 x 0.35: AISEN.Q1 -1.9,0.975; AOUT2.Q2 -1.9,0.325; BISEN.Q4 -1.9,-0.975; BOUT2.Q3 -1.9,-0.325; GND.Q11 1.9,0.325; VCP.Q9 1.9,-0.975; VINT.Q12 1.9,0.975; VM.Q10 1.9,-0.325 | smd 2.1 x 2.1: GND.P0 0,0 | drill 0.3 pad 0.61: GND.P1 -0.65,0.65; GND.P2 0.65,0.65; GND.P3 0,0; GND.P4 -0.65,-0.65; GND.P5 0.65,-0.65
SOT23-5 = smd 0.55 x 1.2: 1 -0.95,-1.3; 2 0,-1.3; 3 0.95,-1.3; 4 0.95,1.3; 5 -0.95,1.3
SOT95P275X110-6N = smd 1.05 x 0.55: 1 -1.25,0.95; 2 -1.25,0; 3 -1.25,-0.95; 4 1.25,-0.95; 5 1.25,0; 6 1.25,0.95
SO016 = smd 0.6 x 1.2: 1 -4.445,-2.8; 2 -3.175,-2.8; 3 -1.905,-2.8; 4 -0.635,-2.8; 5 0.635,-2.8; 6 1.905,-2.8; 7 3.175,-2.8; 8 4.445,-2.8; 9 4.445,2.8; 10 3.175,2.8; 11 1.905,2.8; 12 0.635,2.8; 13 -0.635,2.8; 14 -1.905,2.8; 15 -3.175,2.8; 16 -4.445,2.8
ESP-WROOM32 = smd 1.5 x 0.9: 1 -9,7; 2 -9,5.73; 3 -9,4.46; 4 -9,3.19; 5 -9,1.92; 6 -9,0.65; 7 -9,-0.62; 8 -9,-1.89; 9 -9,-3.16; 10 -9,-4.43; 11 -9,-5.7; 12 -9,-6.97; 13 -9,-8.24; 14 -9,-9.51; 25 9,-9.51; 26 9,-8.24; 27 9,-6.97; 28 9,-5.7; 29 9,-4.43; 30 9,-3.16; 31 9,-1.89; 32 9,-0.62; 33 9,0.65; 34 9,1.92; 35 9,3.19; 36 9,4.46; 37 9,5.73; 38 9,7 | smd 0.9 x 1.5: 15 -5.715,-11; 16 -4.445,-11; 17 -3.175,-11; 18 -1.905,-11; 19 -0.635,-11; 20 0.635,-11; 21 1.905,-11; 22 3.175,-11; 23 4.445,-11; 24 5.715,-11 | smd 6 x 6: TP 0,-0.7 | drill 0.3: TP1 -2,1.3; TP2 0,1.3; TP3 2,1.3; TP4 -2,-0.7; TP5 0,-0.7; TP6 2,-0.7; TP7 -2,-2.7; TP8 0,-2.7; TP9 2,-2.7
USB-A-H = drill 0.8 pad 1.4: D+ -2.718,1.003; D- -2.718,-1.003; GND -2.718,3.493; VBUS -2.718,-3.493 | drill 2: SHLD1 0,6.566; SHLD2 0,-6.566
USB-MICROB-10118194 = smd 1.3 x 0.4: D+ -2.5,0; D- -2.5,-0.65; GND -2.5,1.3; ID -2.5,0.65; VBUS -2.5,-1.3 | drill 0.6 pad 1.2: SHLD1 -2.55,2.55; SHLD2 -2.55,-2.55 | drill 0.5 pad 0.8 long: SHLD3 0.15,3.5; SHLD4 0.15,-3.5 | smd 1.5 x 1.1: SHLD5 0.15,2.85; SHLD6 0.15,-2.85 | smd 1.5 x 1.5: SHLD7 0.15,1; SHLD8 0.15,-1

### Placement (x,y rotation side)
C1  58.55,28.3 0 top
C2  30,28.3 0 top
C3  10,59 180 top
C4  15,63 270 top
C5  42,41 180 top
C6  47.35,43.45 180 top
C7  69,67 90 top
C8  51.7,28.3 0 top
C9  22.2,30.05 0 top
C10  54,71 180 top
C11  57,71 180 top
C12  69,70 90 top
C13  56,30.2 0 top
C14  25.8,30.25 0 top
C15  39,33 90 top
CELL1  17,72 0 bottom
CELL2  32,19.42 180 bottom
CELL3  47,72 0 bottom
CELL4  62,19.42 180 bottom
CONFIG  4,40 90 bottom
D1  22.95,56.05 0 top
D3  23,70 0 top
D4  23,66 0 top
D5  24.45,61 0 top
DIAGNOSTIC  76,16.04 90 bottom
ESD  10.19,68.01 0 top
F1  31,38 270 top
FD1  15,77 0 top
FD2  2,2 0 top
FD3  72,70 0 top
FLASH  3,29 270 bottom
I2C  76,41 270 top
LED1  66,2.54 0 top
LED2  46,2.54 0 top
LED3  26,2.54 0 top
LED4  6,2.54 0 top
LOGO1  62,45 90 bottom
LOGO2  74,54 90 bottom
LOGO3  9.38,26.44 340 top
LOGO4  63.9,28.85 90 top
PH1  70,2.54 90 bottom
PH2  50,2.54 90 bottom
PH3  30,2.54 90 bottom
PH4  10,2.54 90 bottom
POWER  4,56 90 bottom
Q1  31,67 270 top
Q2  41,66 0 top
Q3  17,47 270 top
R1  44,23 270 top
R2  41,23 270 top
R3  38,23 270 top
R4  35,23 270 top
R5  37,52 90 top
R6  39,52 90 top
R7  37,57 90 top
R8  39,57 90 top
R9  34,47 90 top
R10  36,47 90 top
R11  38,47 90 top
R12  40,47 90 top
R13  42,47 90 top
R14  71,26.5 270 top
R15  71,31 90 top
R16  65,5 180 top
R17  45,5 180 top
R18  25,5 180 top
R19  5,5 180 top
R20  47,68 0 top
R21  47,66 0 top
R22  47,64 180 top
R23  47,62 180 top
R24  47,60 180 top
R25  47,58 180 top
R26  47,56 180 top
R27  47,54 180 top
R28  47,52 180 top
R29  47,50 180 top
R30  47,48 180 top
R31  44,35 0 top
R32  34.9,67.1 90 top
R33  13,47 90 top
R34  28,61 90 top
R35  21,61 270 top
RESET  3,19 90 bottom
RGB1  65,40 0 top
RGB2  15,40 0 top
U1  55,22.05 90 top
U2  25,22 90 top
U3  46,39 270 top
U4  23,52 180 top
U5  15,56 270 top
U6  62.5,54 270 top
USB1  70,8.64 270 bottom
USB2  50,8.64 270 bottom
USB3  30,8.64 270 bottom
USB4  10,8.64 270 bottom
USB_IN  2.05,68 0 bottom

### Tracks (layer width: path | path; a pad name or v marks a point on that pad's centre or on a via)
0_IN1  (via drill 0.3)
  Top 0.254: U6.16 53.55,58.45 55.5,56.5 55.5,48.45 v55.65,48.3 | v56.65,42.27 56.65,37.35 60.65,33.35 60.65,24.35 58.67,22.38 58,22.38 | U1.BIN1.Q7 58,22.38 | U1.BIN1.T9 57.27,24.07 58,23.35 58,22.38
  Bottom 0.254: v55.65,48.3 55.9,48.3 56.65,47.55 v56.65,42.27
0_IN2  (via drill 0.3)
  Top 0.254: U6.23 52.7,49.55 53.6,48.65 v53.65,48.65 | v56.15,41.85 56.15,37.31 60.27,33.19 60.27,27 59.47,26.2 57,26.2 56.62,25.82 U1.BIN2.T10 56.62,23.77 56.95,23.45 U1.BIN2.Q8
  Bottom 0.254: v53.65,48.65 56.15,46.15 v56.15,41.85
1_IN1  (via drill 0.3)
  Top 0.254: U6.26 54.26,43.7 53.65,43.09 53.65,32.18 v53.55,32.08 | U1.AIN1.T16 52.73,24.1 52,23.37 52,22.38 | U1.AIN1.Q14 52,22.38 | 52,22.38 50.48,22.38 46.3,26.55 v40.31,26.55
  Bottom 0.254: v53.55,32.08 52.97,32.08 52.48,32.57 42.1,32.57 40.21,30.68 40.21,27.79 39.62,27.2 39.62,26.8 39.87,26.55 v40.31,26.55
1_IN2  (via drill 0.3)
  Top 0.254: U6.27 55.53,44.4 54.03,42.9 54.03,31.78 v53.75,31.5 | U1.AIN2.Q13 53.05,23.55 53.38,23.88 U1.AIN2.T15 53.38,25.93 53,26.3 47.09,26.3 46.44,26.95 40.6,26.95 40.4,27.15 v40.29,27.15
  Bottom 0.254: v53.75,31.5 53.01,31.5 52.32,32.19 42.25,32.19 40.59,30.53 40.59,27.45 v40.29,27.15
2_IN1  (via drill 0.3)
  Top 0.254: v55.3,33.85 54.45,34.7 54.45,42.75 55.65,43.95 56,43.95 56.8,44.75 U6.28 | U2.BIN1.Q7 27.5,22.32 28,22.82 28,24.9 | v38.6,26.55 38.6,26.5 38.4,26.3 33.19,26.3 31.79,24.9 28,24.9 | U2.BIN1.T9 28,24.9
  Bottom 0.254: v55.3,33.85 55.2,33.75 41.65,33.75 39.05,31.15 39.05,28.55 38.15,27.65 38.15,27 v38.6,26.55
2_IN2  (via drill 0.3)
  Top 0.254: U6.29 58.07,44.75 57.27,43.95 56.57,43.95 56.17,43.55 55.82,43.55 54.85,42.58 54.85,35.08 55.8,34.13 55.8,33.38 v55.85,33.33 | v38.65,27.3 38.05,26.7 33.05,26.7 31.65,25.3 28.7,25.3 27.8,26.2 26.95,26.2 26.62,25.88 U2.BIN2.T10 26.62,23.68 26.95,23.35 U2.BIN2.Q8
  Bottom 0.254: v55.85,33.33 41.78,33.33 39.45,31 39.45,28.1 v38.65,27.3
3.3V  (via drill 0.3)
  Top 0.254: RGB2.4 15.55,40.73 14.88,41.4 9.75,41.4 v9.2,41.95 | RGB1.4 67.39,40.03 v68.1,40.03
  Top 0.406: C6.1 47.3,41.65 U3.5 | v52.35,40 49.85,42.5 C6.1 | C6.1 46.35,42.5 44.5,44.35 44.5,51.05 45.45,52 R28.2 46,52.1 46,53.9 R27.2 R26.2 R25.2 R24.2 R23.2 R22.2 | U6.2 68.05,63.18 C7.1 C12.1 v66.05,70
  Bottom 0.254: v9.2,41.95 9.2,42 40.39,42 42.35,40 v52.35,40
  Bottom 0.406: v66.05,70 66.05,45.1 71.05,40.1 | v52.35,40 52.38,40.03 v68.1,40.03 70.98,40.03 71.05,40.1 | 71.05,40.1 72.69,38.46 I2C.2
3_IN1  (via drill 0.3)
  Top 0.254: U6.31 60.61,44.65 59.91,43.95 59.16,43.95 58.36,43.15 56.91,43.15 56.51,42.75 56.1,42.75 55.65,42.3 55.65,35.8 v55.9,35.55 | v23.65,34.05 22.05,34.05 19.7,31.7 19.7,27.1 21.9,24.9 | U2.AIN1.T16 21.9,24.9 | 21.9,24.9 21.9,22.9 22.48,22.32 U2.AIN1.Q14
  Bottom 0.254: v55.9,35.55 25.15,35.55 v23.65,34.05
3_IN2  (via drill 0.3)
  Top 0.254: U6.30 59.34,44.75 58.14,43.55 56.74,43.55 56.34,43.15 55.96,43.15 55.24,42.42 55.24,35.39 v55.74,34.89 | v23.7,33.4 21.95,33.4 20.1,31.55 20.1,27.25 21,26.35 22.95,26.35 23.38,25.93 U2.AIN2.T15 23.38,23.3 U2.AIN2.Q13
  Bottom 0.254: v55.74,34.89 55.49,35.14 25.44,35.14 v23.7,33.4
5V
  Top 0.254: U1.VM.Q10 U1.VM.T12 | U2.VM.Q10 U2.VM.T12
  Top 0.35: C14.2 25.32,28.82 U2.VM.T12 | U1.VM.T12 55.33,26.62 56,27.3 C13.2
  Top 0.406: 42.95,30.55 43.1,30.7 R31.1 42.4,35 40.35,37.05 40.35,39.3 41.1,40.05 C5.1 42.1,39.95 U3.1
  Top 0.813: C15.1 39,32 38,33 36.6,33 34.39,35.21 F1.2 | C14.2 29.95,29.3 C2.1 30,29.9 30.6,30.5 C15.1 | C15.1 39.05,30.55 42.95,30.55 52.55,30.55 53.85,29.25 C13.2 C1.1
A_ISENSE0  (via drill 0.3)
  Top 0.254: v49.65,17.75 48.9,17 45.05,17 41,21.05 R2.2 | v54,17.95 54.02,17.98 U1.AISEN.T3 U1.AISEN.Q1
  Bottom 0.254: v54,17.95 53.85,18.1 50,18.1 v49.65,17.75
A_ISENSE1  (via drill 0.3)
  Top 0.254: R4.2 35,18.55 33.75,17.3 30.5,17.3 v29.75,18.05 | v24,17.7 24.02,17.73 U2.AISEN.T3 U2.AISEN.Q1
  Bottom 0.254: v24,17.7 24.8,18.5 29.3,18.5 v29.75,18.05
B_ISENSE0  (via drill 0.3)
  Top 0.254: v49.1,18.05 48.45,17.4 45.25,17.4 44,18.65 R1.2 | v55.9,18 55.98,18.07 U1.BISEN.T6 U1.BISEN.Q4
  Bottom 0.254: v55.9,18 55.4,18.5 49.55,18.5 v49.1,18.05
B_ISENSE1  (via drill 0.3)
  Top 0.254: R3.2 38,21 33.9,16.9 29.95,16.9 v28.85,18 | v25.9,17.95 25.98,18.02 U2.BISEN.T6 U2.BISEN.Q4
  Bottom 0.254: v28.85,18 27.32,18 v25.9,17.95
BAT_PWR
  Top 1.016: D3.A 18.95,70 17,71.95 CELL1.POS_C
  Bottom 1.016: CELL1.POS_R 17,75.05 | 17,75.05 CELL1.POS_L | CELL1.POS_C 17,75.05
BATT_OFF
  Top 0.254: U4.4 22.35,52.95 22.8,53.4 22.8,56.4 23.45,57.05 D5.2
BATT_PWR_OFF  (via drill 0.3)
  Top 0.254: v26.2,54.85 26.2,53.75 25.4,52.95 U4.3 | R29.1 v49.8,50 | U6.37 68.23,45.92 66.67,47.48 60.37,47.48 58.15,49.7 v58.15,50
  Bottom 0.254: v26.2,54.85 28.35,57 41,57 48,50 v49.8,50 v58.15,50
CONFIG  (via drill 0.3)
  Top 0.254: v52.15,70.05 C10.1 | R12.2 40,49.95 40.92,50.87 40.92,62.27 43.65,65 46.46,65 47,64.46 47,62.45 47.45,62 R23.1 48.75,62 50.05,63.3 50.05,66.5 51.45,67.9 v52.15,67.9 52.7,67.9 56.8,63.8 U6.11
  Bottom 0.254: v52.15,70.05 v52.15,67.9
D+  (via drill 0.3)
  Top 0.254: v6.45,68 7.39,67.06 ESD.3
  Bottom 0.254: USB_IN.D+ v6.45,68
D+_1
  Top 0.254: ESD.4 10.89,67.06 10.44,66.61 10.44,64.44 8.3,62.3 8.3,56.8 9.73,55.37 U5.5
D-  (via drill 0.3)
  Top 0.254: v7.3,69 8.85,69 ESD.1
  Bottom 0.254: USB_IN.D- 6.85,67.35 7.3,67.8 v7.3,69
D-_1
  Top 0.254: U5.6 10.4,54.09 7.85,56.65 7.85,62.39 10.05,64.59 10.05,68.2 10.81,68.96 ESD.6
DTR  (via drill 0.3)
  Top 0.254: R21.1 v40.35,66 Q2.1 | U5.13 18.84,56.63 19.4,57.2 22.15,57.2 v22.2,57.25
  Bottom 0.254: v22.2,57.25 22.2,60.27 25.16,63.22 37.57,63.22 v40.35,66
EN
  Top 0.254: U6.3 66.96,65.79 63.7,69.05 57,69.05 | 49.2,69.05 49.1,68.95 49.1,64.8 48.3,64 R22.1 | R9.2 34,48.85 35.32,50.17 35.32,58.87 38.05,61.6 38.65,61.6 40.38,63.33 | Q2.3 41.65,64.6 40.38,63.33 | 49.2,69.05 57,69.05 | C11.1 57,69.05 | 49.2,69.05 49.1,69.05 48.3,69.85 44.39,69.85 43.51,70.73 41.4,70.73 39.42,68.75 39.42,64.28 40.38,63.33
EN_BASE
  Top 0.254: Q2.5 41,68.35 41.65,69 46.46,69 47,68.46 47,67.5 47.9,66.6 R21.2
FAULT1  (via drill 0.3)
  Top 0.254: R24.1 49.5,60 51.05,61.55 v56,61.55 | U6.7 61.88,62.23 61.2,61.55 v56,61.55 | U1.NFAULT.T8 57.27,19.45 57.8,19.45 v58.3,19.95 | U1.NFAULT.Q6 v58.3,21.73 58.56,21.73 61.03,24.19 61.03,33.51 57.13,37.41 v57.13,41.85 | v56.1,48.9 56,49 v56,60.5 | v56,61.55
  Bottom 0.254: v57.13,41.85 57.13,47.87 v56.1,48.9 | v56,60.5 v56,61.55 | v58.3,19.95 v58.3,21.73
FAULT2  (via drill 0.3)
  Top 0.254: R25.1 48.7,58 50,59.3 50,59.91 51.16,61.07 56.5,61.07 | U6.6 63.15,62.05 62.17,61.07 56.5,61.07 | v53.15,34.25 53.25,34.35 v53.25,43.4 | v27.95,19.9 27.27,19.23 U2.NFAULT.T8 | U2.NFAULT.Q6 | U2.NFAULT.Q6 28.01,21.68 v28.01,21.69 28.41,22.09 28.41,23.64 29.26,24.49 31.94,24.49 33.3,25.85 v38.65,25.85 | v53.7,46.8 56.55,46.8 57.35,47.6 57.35,48.7 56.52,49.53 56.52,61.05 56.5,61.07
  Bottom 0.254: v53.15,34.25 53.07,34.17 41.53,34.17 38.65,31.29 38.65,28.75 37.75,27.85 37.75,26.6 38.5,25.85 v38.65,25.85 | v28.01,21.69 28.01,19.99 28.02,19.98 v27.95,19.9 | v53.25,43.4 53.68,43.83 53.68,46.78 v53.7,46.8
GND  (via drill 0.3)
  Top 0.254: U2.GND.P3 U2.GND.P2 | U1.GND.P3 U1.GND.P4 | U4.2 v26,52 | U1.GND.Q11 U1.GND.T13
  Top 0.35: 24.68,28.12 U2.GND.T13 | U1.GND.T13 54.67,26.88 v53.65,27.9 | U6.38 69.5,44.22 70.78,42.93
  Top 0.36: USB_IN.SHLD1 6.1,70.55 | USB_IN.SHLD3 1.9,72.55 | USB_IN.SHLD3 3.5,71.5 | USB_IN.SHLD4 1.9,63.4 | USB_IN.SHLD4 3.45,64.5 | USB_IN.SHLD2 4.6,64.35 | USB_IN.SHLD2 5.65,65.45 | USB_IN.SHLD1 4.6,71.65 | USB_IN.SHLD4 0.75,64.5 | USB_IN.SHLD3 0.75,71.5 | USB_IN.SHLD2 3.6,65.45 | USB_IN.SHLD1 3.55,70.55
  Bottom 0.36: USB_IN.SHLD1 6.05,70.55 | USB_IN.SHLD1 4.6,71.6 | 3.5,71.5 USB_IN.SHLD3 1.9,72.55 | 1.9,63.4 USB_IN.SHLD4 3.45,64.5 | USB_IN.SHLD2 4.6,64.35 | USB_IN.SHLD2 5.65,65.45 | USB_IN.SHLD6 USB_IN.SHLD8 USB_IN.SHLD7 USB_IN.SHLD5 | USB_IN.SHLD1 3.55,70.55 | USB_IN.SHLD2 3.55,65.45
  Bottom 0.381: 6.15,69.3 USB_IN.GND 3.45,69.3 | USB_IN.SHLD4 0.7,64.5 | USB_IN.SHLD3 0.75,71.5
  Bottom 1.016: CELL4.NEG_L 62,75.05 | 62,75.05 CELL4.NEG_R | CELL4.NEG_C 62,75.05
  other vias: 51.75,63.45 53.75,68.35 70.4,68.5 71.05,64.95 42.45,67.7 10.8,63 38.45,62.75 50,45.7 50.05,51.45 51.55,46.05 53.5,47.65 51.9,20.75 50.25,19.55 58.25,18.65 59.55,20.95 53.75,30.65 20.25,18.15 28.1,19.05 26.15,27.55 25.4,33.6 6.95,14.95 23.4,27.95 37.75,28.65 39.15,23.4 41.25,28.65 39.05,40.5 38.55,37.75 37.55,32 40.3,33.9 70,72 69.8,61.2 69.8,46.8 57.7,42.5 67.7,42.55 40.3,51.95 52.3,38 40.8,42.55 23.5,37.75 41.1,37.9 55.45,32.6 65.2,46.45 67,48.05 69.85,31.05 55.25,46.2 41.8,34.65 35.45,44.4 25.5,40.3 67,61.35 51.9,25 55.55,47.55 53.15,59.7 39.8,71.85 38.6,33.8 52.15,42 49.75,57.4 25.8,58.15 57.9,46.6 40.4,62.1 23.55,45.3 58.45,25.15 36.75,54.9 70.95,33.8
  pour Bottom (isolate 0.191, rank 6): -1,-1 -1,81 81,81 81,-1
  pour Top (isolate 0.191, rank 6): -2,-2 -2,82 82,82 82,-2
INPUT_PWR
  Top 0.813: F1.1 Q1.3 D4.C
IO0  (via drill 0.3)
  Top 0.254: Q2.6 40.35,68.5 41.7,69.85 v42,69.85 | R28.1 47.35,52 47,51.65 47,47.45 47.6,46.85 49.95,46.85 51,45.8 v51,45 U6.25 | v41.4,61.95 41.4,50.65 v40.65,49.9 40.65,49.25 R13.2
  Bottom 0.254: v42,69.85 43.05,68.8 43.05,63.6 v41.4,61.95 | v40.65,49.9 45.55,45 v51,45
IO0_BASE
  Top 0.254: Q2.2 41,64.5 40.75,64.25 40.05,64.25 39.8,64.5 39.8,68.54 41.61,70.35 43.35,70.35 44.25,69.45 47.2,69.45 47.9,68.75 R20.2
LED1_B  (via drill 0.3)
  Top 0.254: RGB1.3 68.08,39.27 68.7,39.9 v68.7,40.65 | R6.1 39,45 v38.75,44.75
  Bottom 0.254: v68.7,40.65 68.56,40.51 44.59,40.51 40.35,44.75 v38.75,44.75
LED1_G  (via drill 0.3)
  Top 0.254: v67.9,41.45 67.85,41.4 65.6,41.4 65.05,40.85 65.05,40.02 64.3,39.27 RGB1.2 | v39.05,54.95 39.05,56.05 R8.1
  Bottom 0.254: v39.05,54.95 39.5,54.5 39.5,46.75 44.9,41.35 67.8,41.35 v67.9,41.45
LED1_R  (via drill 0.3)
  Top 0.254: RGB1.1 63.3,41.23 64.08,42 68.05,42 68.4,41.65 v68.4,41.15 | v38.5,47 38,46.5 R11.1
  Bottom 0.254: v68.4,41.15 68.2,40.95 44.7,40.95 38.65,47 v38.5,47
LED2_B  (via drill 0.3)
  Top 0.254: RGB2.3 17.6,39.27 18.1,39.77 18.1,41.17 17.47,41.8 10.2,41.8 v9.05,42.95 | v38,49.65 37.85,49.65 37,50.5 R5.1
  Bottom 0.254: v9.05,42.95 9.15,42.85 36.3,42.85 37.85,44.4 37.85,49.5 v38,49.65
LED2_G  (via drill 0.3)
  Top 0.254: v8,44.05 8,41.73 10.45,39.27 RGB2.2 | v38.35,54.95 37.7,54.95 37,55.65 R7.1
  Bottom 0.254: v38.35,54.95 38.35,51.6 37.45,50.7 37.45,45.55 35.55,43.65 9.7,43.65 9.3,44.05 v8,44.05
LED2_R  (via drill 0.3)
  Top 0.254: RGB2.1 9.6,40.73 8.5,41.83 v8.5,43.55 | v37.1,44.35 36,45.45 R10.1
  Bottom 0.254: v8.5,43.55 9.2,43.55 9.5,43.25 36,43.25 v37.1,44.35
MOT_0N
  Top 0.254: 55.33,19 U1.BOUT2.T5 U1.BOUT2.Q3
  Top 0.35: 55.33,19 55.33,14.88 57.2,13 64.86,13 USB1.GND | PH1.1 LED1.2
  Bottom 0.35: USB1.GND 66.51,9 | 66.51,9 66.51,4.49 68.46,2.54 PH1.1 | PH1.3 67.21,9 66.51,9
MOT_0P
  Top 0.254: PH1.4 67.49,6.74 65.9,5.15 R16.1
  Top 0.35: PH1.4 PH1.2 73.49,8.48 USB1.VBUS 73.49,12.2 72.15,13.55 57.35,13.55 55.92,14.97 55.92,17.25 56.62,17.95 U1.BOUT1.T7 56.62,20.23 56.95,20.55 U1.BOUT1.Q5
MOT_1N
  Top 0.254: 54.67,19 U1.AOUT2.T4 U1.AOUT2.Q2
  Top 0.35: 54.67,19 54.67,10.18 54.3,9.8 54.3,4.34 52.5,2.54 PH2.1 LED2.2
  Bottom 0.35: PH2.1 48.46,2.54 46.51,4.49 46.51,9.04 | 46.51,9.04 PH2.3 | USB2.GND 46.51,9.04
MOT_1P
  Top 0.254: PH2.4 48.19,6.8 47.6,6.8 45.9,5.1 R17.1
  Top 0.35: PH2.4 PH2.2 53.49,8.48 USB2.VBUS 53.49,17.43 53.38,17.53 U1.AOUT1.T2 53.38,20.23 53,20.6 53,21.07 U1.AOUT1.Q16
MOT_2N
  Top 0.254: U2.BOUT2.T5 25.32,20
  Top 0.35: U2.BOUT2.Q3 25.32,20 25.32,14.74 26.51,13.55 USB3.GND | PH3.1 LED3.2
  Bottom 0.35: PH3.1 28.21,2.54 26.51,4.24 26.51,9 | 26.51,9 USB3.GND | PH3.3 26.55,9.04 26.51,9
MOT_2P
  Top 0.254: R18.1 25.9,5.14 27.5,6.74 PH3.4
  Top 0.35: PH3.4 PH3.2 33.5,8.49 USB3.VBUS 33.49,12.48 32.43,13.75 27.05,13.75 25.82,14.97 25.82,17.1 26.62,17.9 U2.BOUT1.T7 26.62,20.07 27,20.45 27,21.02 U2.BOUT1.Q5
MOT_3N
  Top 0.254: U2.AOUT2.T4 24.68,20
  Top 0.35: U2.AOUT2.Q2 24.68,20 24.68,15.88 22.39,13.59 17.5,13.59 14.3,10.39 14.3,4.44 12.4,2.54 PH4.1 LED4.2
  Bottom 0.35: PH4.1 8.36,2.54 6.46,4.44 6.46,9 | USB4.GND 6.46,11.3 6.46,9 | PH4.3 6.5,9.04 6.46,9
MOT_3P
  Top 0.254: PH4.4 7.47,6.74 5.96,5.23 R19.1
  Top 0.35: U2.AOUT1.Q16 23,21.02 23,20.6 23.38,20.23 U2.AOUT1.T2 23.38,15.28 22.23,14.12 16.26,14.12 USB4.VBUS 13.5,8.49 PH4.2 PH4.4
N$1
  Top 0.254: R31.2 44.9,37.85 U3.3
N$2
  Top 0.254: U5.4 10.37,56.63 10,57 C3.1
N$3
  Top 0.254: D5.3 26,61 27,60 27.9,60 R34.1
N$4  (via drill 0.3)
  Top 0.254: U4.1 24.25,50.65 23.55,49.95 v22.3,49.95
  Bottom 0.254: POWER.1 4,55 12,55 17.05,49.95 v22.3,49.95
N$5
  Top 0.254: U4.6 20.95,51.05 20,52 20,55.7 20.35,56.05 D1.C
N$6  (via drill 0.3)
  Top 0.254: v37.05,40.95 37.05,43.55 35.45,45.15 34.5,45.15 34,45.65 R9.1
  Bottom 0.254: v37.05,40.95 36.79,41.21 10.96,41.21 8.6,38.85 8.6,25.6 5.15,22.15 RESET.2
N$7
  Bottom 1.016: CELL2.POS_R 32,16.37 | 32,16.37 CELL2.POS_L CELL1.NEG_L 17,16.37 | 17,16.37 CELL1.NEG_R | CELL2.POS_C 32,16.37 | CELL1.NEG_C 17,16.37
N$8
  Bottom 1.016: CELL2.NEG_L 32,75.05 | 32,75.05 CELL2.NEG_R CELL3.POS_R 47,75.05 | 47,75.05 CELL3.POS_L | CELL3.POS_C 47,75.05 | CELL2.NEG_C 32,75.05
N$10
  Bottom 1.016: CELL4.POS_R 62,16.37 | 62,16.37 CELL4.POS_L CELL3.NEG_L 47,16.37 | 47,16.37 CELL3.NEG_R | CELL3.NEG_C 47,16.37 | CELL4.POS_C 62,16.37
N$11
  Top 0.254: LED1.1 64.25,3.04 64.25,4.94 64.1,4.94 R16.2
N$12  (via drill 0.3)
  Top 0.254: v39.15,43.2 40,44.05 R12.1
  Bottom 0.254: v39.15,43.2 38.4,42.45 7.45,42.45 CONFIG.1
N$13
  Top 0.254: LED2.1 44.3,2.99 44.3,4.89 44.06,4.89 R17.2
N$14
  Top 0.254: LED3.1 24.3,2.99 24.3,5 R18.2
N$15  (via drill 0.3)
  Top 0.254: v26.7,64.65 26.7,63.2 R34.2 | R32.2 Q1.1 31.95,68.8 29.25,71.5 v26.7,71.5
  Bottom 0.254: v26.7,71.5 v26.7,64.65
N$16  (via drill 0.3)
  Top 0.254: v22.95,58.65 22.55,59.05 21.5,59.05 21,59.55 R35.2 | Q3.1 15.95,47.9 R33.2 v8.95,47.9
  Bottom 0.254: v8.95,47.9 22.05,47.9 23.6,49.45 23.6,58 v22.95,58.65
N$17
  Top 0.254: LED4.1 4.3,2.99 4.3,4.8 R19.2
N$31  (via drill 0.3)
  Top 0.254: v39,41.5 42,44.5 R13.1
  Bottom 0.254: v39,41.5 38.91,41.59 10.74,41.59 8,38.85 8,29 4.85,25.85 FLASH.2
NSLEEP  (via drill 0.3)
  Top 0.254: v52.2,43.25 52.84,42.61 52.84,36.15 v52.74,36.05 v52.75,36.04 52.75,34.9 52.65,34.8 52.65,33.95 53.17,33.43 v53.17,32.7 | U1.NSLEEP.Q15 51.62,21.73 v51.1,21.2 46.13,26.17 40.72,26.17 v40.3,25.75 | U2.NSLEEP.T1 22.73,19.25 v21.6,19.25 | U1.NSLEEP.T1 52.73,19.6 v51.8,19.6 | v23.65,34.85 22.25,34.85 19.31,31.91 19.31,26.91 21.51,24.71 21.51,21.61 v21.26,21.36 21.56,21.66 21.55,21.68 U2.NSLEEP.Q15 | R30.1 48.17,48.27 50.27,48.27 50.28,48.28 U6.24 51.9,47.88 v51.9,47
  Bottom 0.254: v52.74,36.05 52.71,36.08 24.88,36.08 v23.65,34.85 | v21.6,19.25 21.26,19.59 v21.26,21.36 | v51.8,19.6 51.1,20.3 v51.1,21.2 | v51.9,47 52.2,46.7 v52.2,43.25 | v53.17,32.7 52.92,32.95 41.94,32.95 39.83,30.84 39.83,27.95 39.24,27.36 39.24,26.61 40.1,25.75 v40.3,25.75
RTS  (via drill 0.3)
  Top 0.254: Q2.4 41.65,68.2 v41.7,68.25 41.75,68.3 45.8,68.3 R20.1 | U5.14 19.2,57.91 19.4,57.7 v21.59,57.7 v21.6,57.7
  Bottom 0.254: v21.6,57.7 21.6,60.25 24.95,63.6 37.05,63.6 v41.7,68.25
RXD0
  Top 0.254: U6.34 64.42,44.28 65.6,43.1 68.78,43.1 72.65,39.23 72.65,32.75 71.8,31.9 R15.2
SCL  (via drill 0.3)
  Top 0.254: v50.1,56 R26.1 | I2C.3 74.65,35.92 73.46,37.11 73.46,39.55 69.15,43.86 67.29,43.86 67,44.15 67,44.96 U6.36 67,45.04 67,46.5 66.4,47.1 60.12,47.1 57.6,49.62 57.6,55.4 v57,56
  Bottom 0.254: v50.1,56 50.15,56.05 56.95,56.05 v57,56
SDA  (via drill 0.3)
  Top 0.254: v50.1,54.05 50.05,54 R27.1 | v70.6,35.6 63.65,35.6 61.45,37.8 61.45,41.95 63.15,43.65 U6.33 63.15,46 62.45,46.7 59.95,46.7 57.1,49.55 v57.1,54.05
  Bottom 0.254: I2C.4 72.8,33.38 70.6,35.58 v70.6,35.6 | v57.1,54.05 v50.1,54.05
SLED1_B  (via drill 0.3)
  Top 0.254: R6.2 40.38,54.28 40.38,57.78 v40.4,57.8 | v55.25,64.5 55.5,64.25 55.5,63.03 U6.12
  Bottom 0.254: v40.4,57.8 41.99,59.39 46.37,59.39 51.04,64.06 53.39,64.06 53.96,64.64 55.11,64.64 v55.25,64.5
SLED1_G  (via drill 0.3)
  Top 0.254: U6.14 52.99,64.61 v52.6,65 | v40.35,59.75 39,58.4 R8.2
  Bottom 0.254: v52.6,65 50.9,65 46.05,60.15 40.75,60.15 v40.35,59.75
SLED1_R  (via drill 0.3)
  Top 0.254: R11.2 38,48.4 36.1,50.3 36.1,58.55 38,60.45 v38.65,60.45 | v53.25,66.25 54.25,65.25 U6.13
  Bottom 0.254: v38.65,60.45 39.2,61 45.81,61 51.06,66.25 v53.25,66.25
SLED2_B  (via drill 0.3)
  Top 0.254: R5.2 38.1,54 39,54 39.9,54.9 39.9,58.15 v40.4,58.65 | v55.8,66.45 56.2,66.45 58.07,64.58 U6.10
  Bottom 0.254: v40.4,58.65 41.52,59.77 46.21,59.77 50.88,64.45 53.23,64.45 53.95,65.17 54.27,65.17 55.55,66.45 v55.8,66.45
SLED2_G  (via drill 0.3)
  Top 0.254: v38.7,59.8 37.9,59.8 37,58.9 R7.2 | U6.9 59.34,63.91 56.3,66.95 v55.4,66.95
  Bottom 0.254: v38.7,59.8 39.45,60.55 45.9,60.55 51,65.65 53.95,65.65 55.25,66.95 v55.4,66.95
SLED2_R  (via drill 0.3)
  Top 0.254: v38.35,61 38,61 35.7,58.7 35.7,50.15 36,49.85 R10.2 | v55.35,67.6 56.21,67.6 59.81,64 60.31,64 60.61,63.7 U6.8
  Bottom 0.254: v38.35,61 38.73,61.38 45.6,61.38 51.23,67 54.75,67 v55.35,67.6
TXD0
  Top 0.254: U6.35 65.69,44.06 66.27,43.48 68.94,43.48 73.03,39.39 73.03,28.59 71.85,27.4 R14.1
USB_RXD  (via drill 0.3)
  Top 0.254: U5.2 13.82,59.17 16,57 16,50.45 23.35,43.1 23.35,40.8 24.15,40 24.15,39.4 v23.7,38.95 | DIAGNOSTIC.4 75.73,23.65 71,23.65 69.7,24.95 69.7,28.16 71,29.46 R15.1
  Bottom 0.254: v23.7,38.95 23.85,39.1 63.15,39.1 73.65,28.6 73.65,25.35 75.34,23.66 DIAGNOSTIC.4
USB_TXD  (via drill 0.3)
  Top 0.254: v23.65,39.75 23.65,39.79 22.97,40.47 22.97,42.88 18.85,47 Q3.3 | R14.2 72.5,25.6 73.1,26.2 DIAGNOSTIC.5
  Bottom 0.254: v23.65,39.75 23.88,39.52 63.29,39.52 74.03,28.78 74.03,26.97 74.8,26.2 DIAGNOSTIC.5
USB_TXD_SW
  Top 0.254: Q3.2 17,47.05 17,48.91 15.62,50.29 15.62,56.73 14.45,57.91 U5.3
V_BATT
  Top 0.254: D3.C 25.15,68.35 23.8,67 23.8,63.8 24.5,63.1 24.5,56.35 D1.A
  Top 0.813: Q1.2 29,68 27,70 D3.C
V_USB  (via drill 0.3)
  Top 0.254: U5.16 17.8,62.2 17,63 C4.1 16,63.05 16,65 14,67 v14,68 | D4.A 21,65.85 21,65.05 23.45,62.6 D5.1 21.05,61.95 R35.1
  Top 0.356: v14,68 ESD.5
  Top 0.508: v14,68 17,68 19,66 D4.A 22.55,67.7 22.55,70.6 24.35,72.4 24.35,76.15 26.2,78 59.6,78 65.6,72 v67.05,72
  Bottom 0.356: 7,66.7 USB_IN.VBUS
  Bottom 0.508: v14,68 12.7,66.7 7,66.7 | v67.05,72 68,71.05 68,45 70,43 76.22,43 78,41.22 78,23 76.12,21.12 DIAGNOSTIC.3
VCP0
  Top 0.254: C1.2 57.35,27.35 55.98,25.98 U1.VCP.T11 U1.VCP.Q9
VCP1
  Top 0.254: C2.2 27.35,27.35 25.98,25.98 U2.VCP.T11 U2.VCP.Q9
VINT0
  Top 0.254: C8.2 52.65,27.35 54.02,25.98 U1.VINT.T14 U1.VINT.Q12
VINT1
  Top 0.254: C9.2 23.1,29.1 24,28.2 24,24.93 U2.VINT.T14 U2.VINT.Q12

### Text on the board
tPlace: Kadah - May 2020 | JLCJLCJLCJLC | VihHub 2.1 Rev.C2 | 4 | 3 | 2 | 1
bPlace: VihHub / 2.1 / Rev.C2 | Rechargeable batteries recommended | https://vibhub.io/ | SPFMDB | Green | RXD | TXD | 5V | GND | 4 | 3 | 2 | 1
tNames: GND | 3.3V | SCL | SDA